# EAGLE design Easy_RFPA_RevB_S2 (EAGLE 6.6.0)
AUTHOR: MDT; BOMREV: 01; FABREV: B
Assembly variants: IRF520N_20W, IRF630_200W

## Sheet 1 of 4: Push-pull power stage
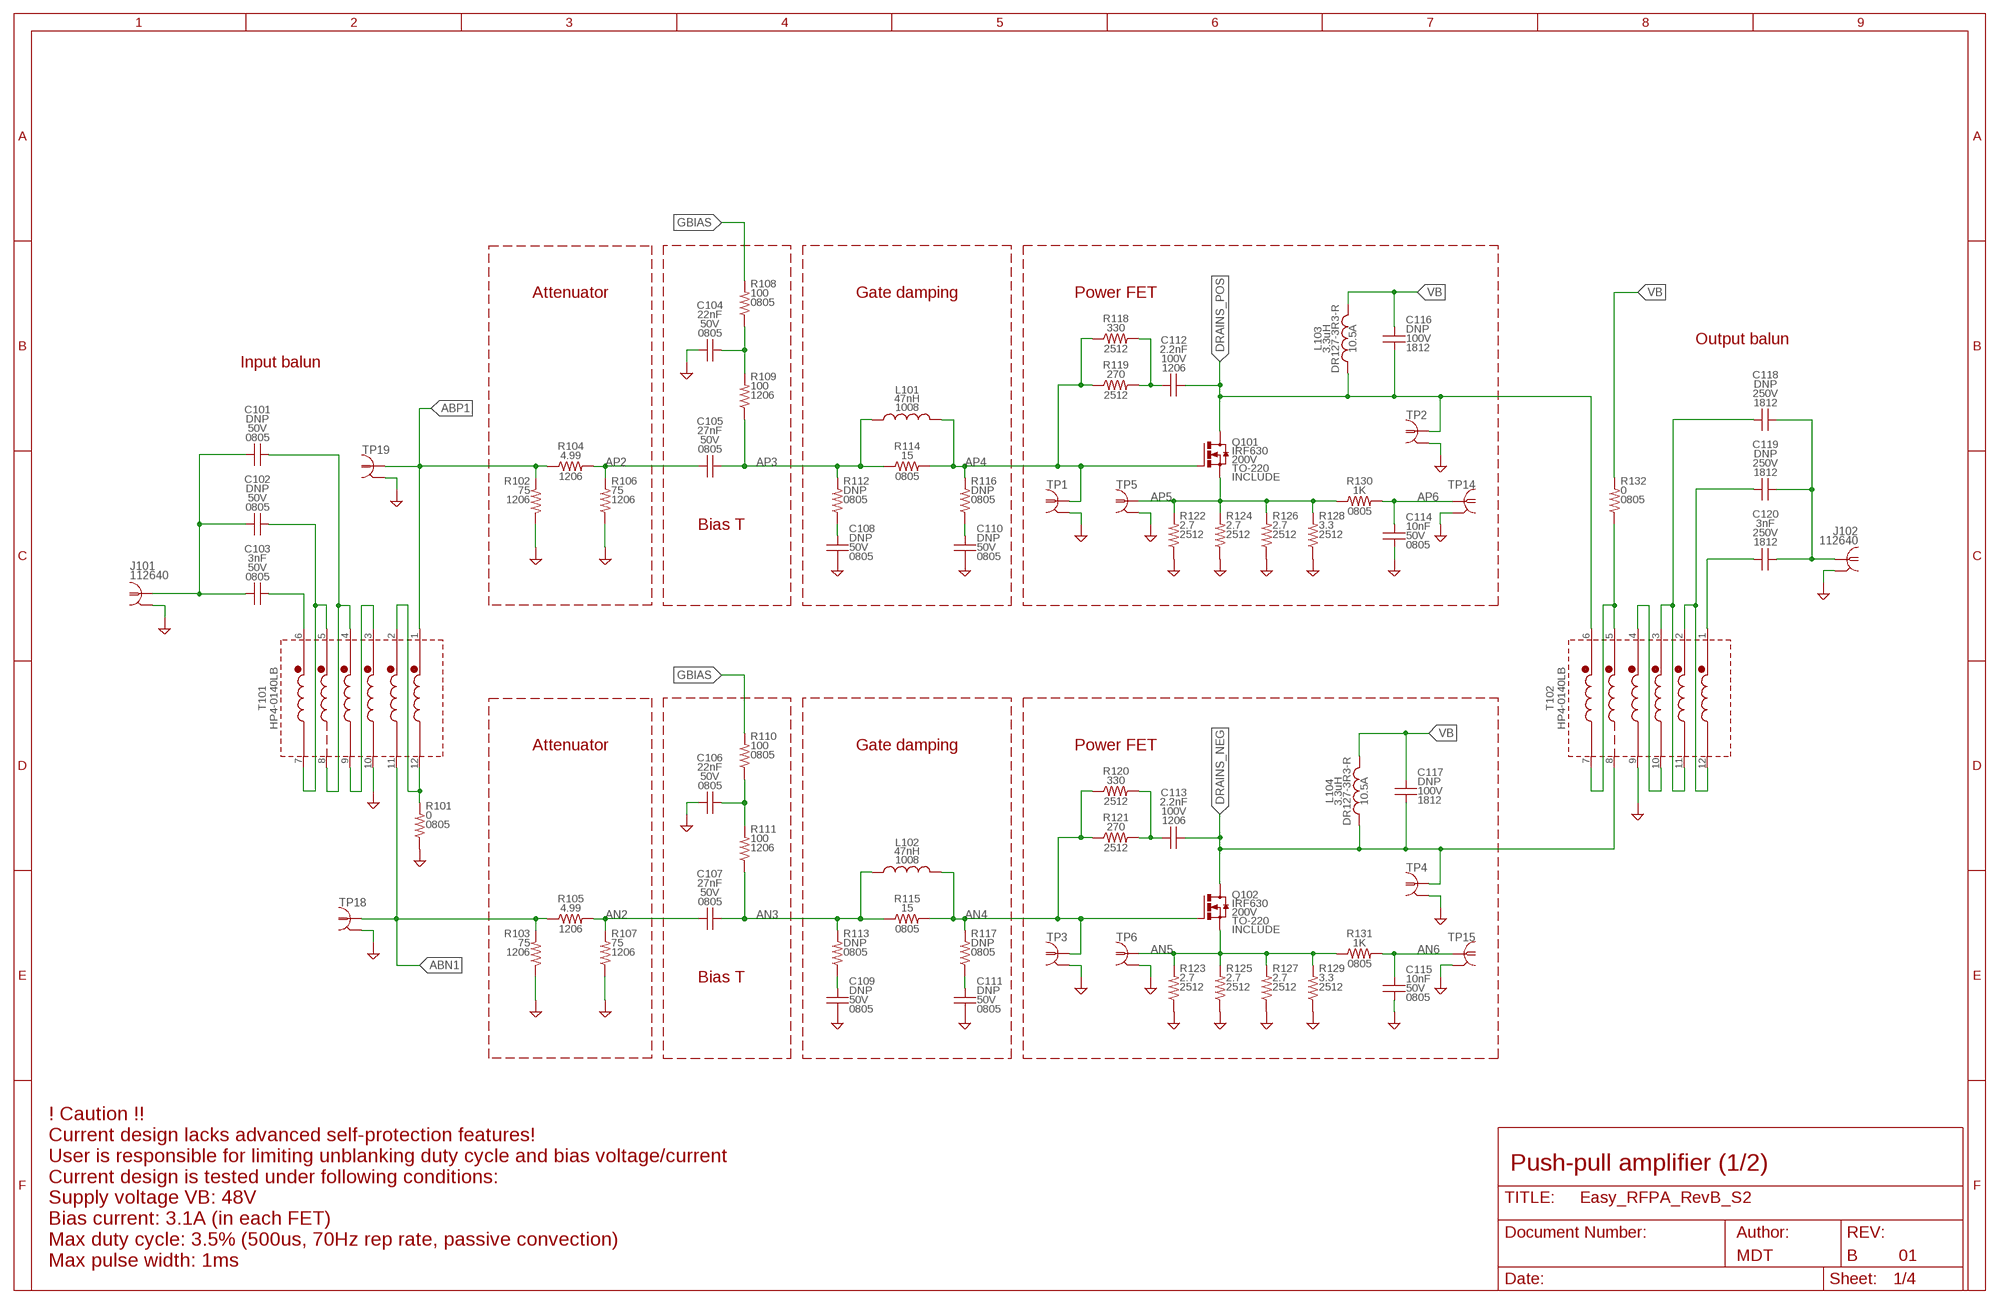
[diagram p0: schematic, sheet 1]

### Parts
C101  DNP  CGEN0805_IPC  [0805_IPC-7351B]  (not fitted in variant IRF630_200W)
C102  DNP  CGEN0805_IPC  [0805_IPC-7351B]  (not fitted in variant IRF520N_20W)  (not fitted in variant IRF630_200W)
C103  3nF  CGEN0805_IPC  [0805_IPC-7351B]  (not fitted in variant IRF520N_20W)
C104  22nF  CGEN0805_IPC  [0805_IPC-7351B]
C105  27nF  CGEN0805_IPC  [0805_IPC-7351B]
C106  22nF  CGEN0805_IPC  [0805_IPC-7351B]
C107  27nF  CGEN0805_IPC  [0805_IPC-7351B]
C108  DNP  CGEN0805_IPC  [0805_IPC-7351B]  (not fitted in variant IRF520N_20W)  (not fitted in variant IRF630_200W)
C109  DNP  CGEN0805_IPC  [0805_IPC-7351B]  (not fitted in variant IRF520N_20W)  (not fitted in variant IRF630_200W)
C110  DNP  CGEN0805_IPC  [0805_IPC-7351B]  (not fitted in variant IRF520N_20W)  (not fitted in variant IRF630_200W)
C111  DNP  CGEN0805_IPC  [0805_IPC-7351B]  (not fitted in variant IRF520N_20W)  (not fitted in variant IRF630_200W)
C112  2.2nF  CGENC1206  [C1206]
C113  2.2nF  CGENC1206  [C1206]
C114  10nF  CGEN0805_IPC  [0805_IPC-7351B]
C115  10nF  CGEN0805_IPC  [0805_IPC-7351B]
C116  DNP  CGENC1812  [C1812]
C117  DNP  CGENC1812  [C1812]
C118  DNP  CGENC1812  [C1812]  (not fitted in variant IRF630_200W)
C119  DNP  CGENC1812  [C1812]  (not fitted in variant IRF520N_20W)  (not fitted in variant IRF630_200W)
C120  3nF  CGENC1812  [C1812]  (not fitted in variant IRF520N_20W)  (variant IRF630_200W: 1.5nF)
J101  COAX112640BNC_EDGE  [BNC_EDGE]
J102  COAX112640BNC_EDGE  [BNC_EDGE]
L101  47nH  L_CHIPL-47N-AIR-5%-1008-1A1008  [L1008]
L102  47nH  L_CHIPL-47N-AIR-5%-1008-1A1008  [L1008]
L103  3.3uH  LL-3.3U-FERRITE-20%-12.5X12.5MM-10.5A  [DR127]  (variant IRF520N_20W: 22uH)
L104  3.3uH  LL-3.3U-FERRITE-20%-12.5X12.5MM-10.5A  [DR127]  (variant IRF520N_20W: 22uH)
Q101  IRF520N  MOSFET_NIRF630TO-220-VERT  [TO220BV]
Q102  IRF630  MOSFET_NIRF630TO-220-VERT  [TO220BV]
R101  0  RGEN0805_IPC  [0805_IPC-7351B]
R102  75  RGEN1206_IPC  [1206_IPC-7351B]
R103  75  RGEN1206_IPC  [1206_IPC-7351B]
R104  4.99  R90GEN1206_IPC  [1206_IPC-7351B]
R105  4.99  R90GEN1206_IPC  [1206_IPC-7351B]
R106  75  RGEN1206_IPC  [1206_IPC-7351B]
R107  75  RGEN1206_IPC  [1206_IPC-7351B]
R108  100  RGEN0805_IPC  [0805_IPC-7351B]
R109  100  RGEN1206_IPC  [1206_IPC-7351B]
R110  100  RGEN0805_IPC  [0805_IPC-7351B]
R111  100  RGEN1206_IPC  [1206_IPC-7351B]
R112  DNP  RGEN0805_IPC  [0805_IPC-7351B]  (not fitted in variant IRF520N_20W)  (not fitted in variant IRF630_200W)
R113  DNP  RGEN0805_IPC  [0805_IPC-7351B]  (not fitted in variant IRF520N_20W)  (not fitted in variant IRF630_200W)
R114  15  R90GEN0805_IPC  [0805_IPC-7351B]
R115  15  R90GEN0805_IPC  [0805_IPC-7351B]
R116  DNP  RGEN0805_IPC  [0805_IPC-7351B]  (not fitted in variant IRF520N_20W)  (not fitted in variant IRF630_200W)
R117  DNP  RGEN0805_IPC  [0805_IPC-7351B]  (not fitted in variant IRF520N_20W)  (not fitted in variant IRF630_200W)
R118  330  R90GENR2512  [R2512]
R119  270  R90GENR2512  [R2512]
R120  330  R90GENR2512  [R2512]
R121  270  R90GENR2512  [R2512]
R122  2.7  RGENR2512  [R2512]
R123  2.7  RGENR2512  [R2512]
R124  2.7  RGENR2512  [R2512]
R125  2.7  RGENR2512  [R2512]
R126  2.7  RGENR2512  [R2512]
R127  2.7  RGENR2512  [R2512]
R128  3.3  RGENR2512  [R2512]
R129  3.3  RGENR2512  [R2512]
R130  1K  R90GEN0805_IPC  [0805_IPC-7351B]
R131  1K  R90GEN0805_IPC  [0805_IPC-7351B]
R132  0  RGEN0805_IPC  [0805_IPC-7351B]
T101  HP4_TRAFO  [HP4]
T102  HP4_TRAFO  [HP4]
TP1  PROBE_TPTP_5MM  [PROBE_TP_5MM]
TP2  PROBE_TPTP_7P5MM  [PROBE_TP_7P5MM]
TP3  PROBE_TPTP_5MM  [PROBE_TP_5MM]
TP4  PROBE_TPTP_7P5MM  [PROBE_TP_7P5MM]
TP5  PROBE_TPTP_7P5MM  [PROBE_TP_7P5MM]
TP6  PROBE_TPTP_7P5MM  [PROBE_TP_7P5MM]
TP14  PROBE_TPTP_5MM  [PROBE_TP_5MM]
TP15  PROBE_TPTP_5MM  [PROBE_TP_5MM]
TP18  PROBE_TPTP_5MM  [PROBE_TP_5MM]
TP19  PROBE_TPTP_5MM  [PROBE_TP_5MM]

### Nets
ABN1: R103.1 R105.1 T101.11(F2) TP18.TP ; also sheet 2
ABP1: R102.1 R104.1 T101.1(S1) TP19.TP ; also sheet 2
AN2: C107.2 R105.2 R107.1
AN3: C107.1 L102.1 R111.2 R113.1 R115.1
AN4: L102.2 Q102.G R115.2 R117.1 R120.1 R121.1 TP3.TP
AN5: Q102.S R123.1 R125.1 R127.1 R129.1 R131.1 TP6.TP
AN6: C115.1 R131.2 TP15.TP
AP2: C105.2 R104.2 R106.1
AP3: C105.1 L101.1 R109.2 R112.1 R114.1
AP4: L101.2 Q101.G R114.2 R116.1 R118.1 R119.1 TP1.TP
AP5: Q101.S R122.1 R124.1 R126.1 R128.1 R130.1 TP5.TP
AP6: C114.1 R130.2 TP14.TP
DRAINS_NEG [32W_20S]: C113.2 C117.2 L104.1 Q102.D T102.8(F5) TP4.TP ; also sheet 2
DRAINS_POS [32W_30S]: C112.2 C116.2 L103.1 Q101.D T102.6(S6) TP2.TP ; also sheet 2
GBIAS: R108.1 R110.1 ; also sheet 2,3
GND: C104.2 C106.2 C108.2 C109.2 C110.2 C111.2 C114.2 C115.2 J101.G1(GND1) J101.G2(GND1) J101.G3(GND1) J101.G4(GND1) J102.G1(GND1) J102.G2(GND1) J102.G3(GND1) J102.G4(GND1) R101.2 R102.2 R103.2 R106.2 R107.2 R122.2 R123.2 R124.2 R125.2 R126.2 R127.2 R128.2 R129.2 T101.10(F3) T102.9(F4) TP1.GND(GND1) TP2.GND(GND1) TP3.GND(GND1) TP4.GND(GND1) TP5.GND(GND1) TP6.GND(GND1) TP14.GND(GND1) TP15.GND(GND1) TP18.GND(GND1) TP19.GND(GND1) ; also sheet 2,3,4
N$4: C113.1 R120.2 R121.2
N$5: C109.1 R113.2
N$8: C104.1 R108.2 R109.1
N$10: C108.1 R112.2
N$11: C110.1 R116.2
N$12: C112.1 R118.2 R119.2
N$13: C106.1 R110.2 R111.1
N$17: C111.1 R117.2
N$22: T101.3(S3) T101.9(F4)
N$27: R101.1 T101.2(S2) T101.12(F1)
N$29 [32W_30S]: C119.1 T102.2(S2) T102.12(F1)
N$30 [32W_30S]: C120.1 T102.1(S1)
N$31 [32W_30S]: C118.2 C119.2 C120.2 J102.C
N$34: C101.2 C102.2 C103.2 J101.C
N$41: C103.1 T101.6(S6)
N$52 [32W_30S]: C118.1 T102.3(S3) T102.11(F2)
N$57: C101.1 T101.4(S4) T101.8(F5)
N$58 [32W_30S]: T102.4(S4) T102.10(F3)
VB [50W_30S]: C116.1 C117.1 L103.2 L104.2 R132.1 ; also sheet 4
VB_CT [32W_30S]: R132.2 T102.5(S5) T102.7(F6)
VB_CT1: C102.1 T101.5(S5) T101.7(F6)

### Notes on the sheet
- Attenuator | Gate damping | Power FET
- Output balun
- Input balun
- Bias T
- Attenuator | Gate damping | Power FET
- Bias T
- Push-pull amplifier (1/2)
- ! Caution !!
  Current design lacks advanced self-protection features!
  User is responsible for limiting unblanking duty cycle and bias voltage/current
  Current design is tested under following conditions:
  Supply voltage VB: 48V
  Bias current: 3.1A (in each FET)
  Max duty cycle: 3.5% (500us, 70Hz rep rate, passive convection)
  Max pulse width: 1ms

## Sheet 2 of 4: Parallel copy of push-pull power stage
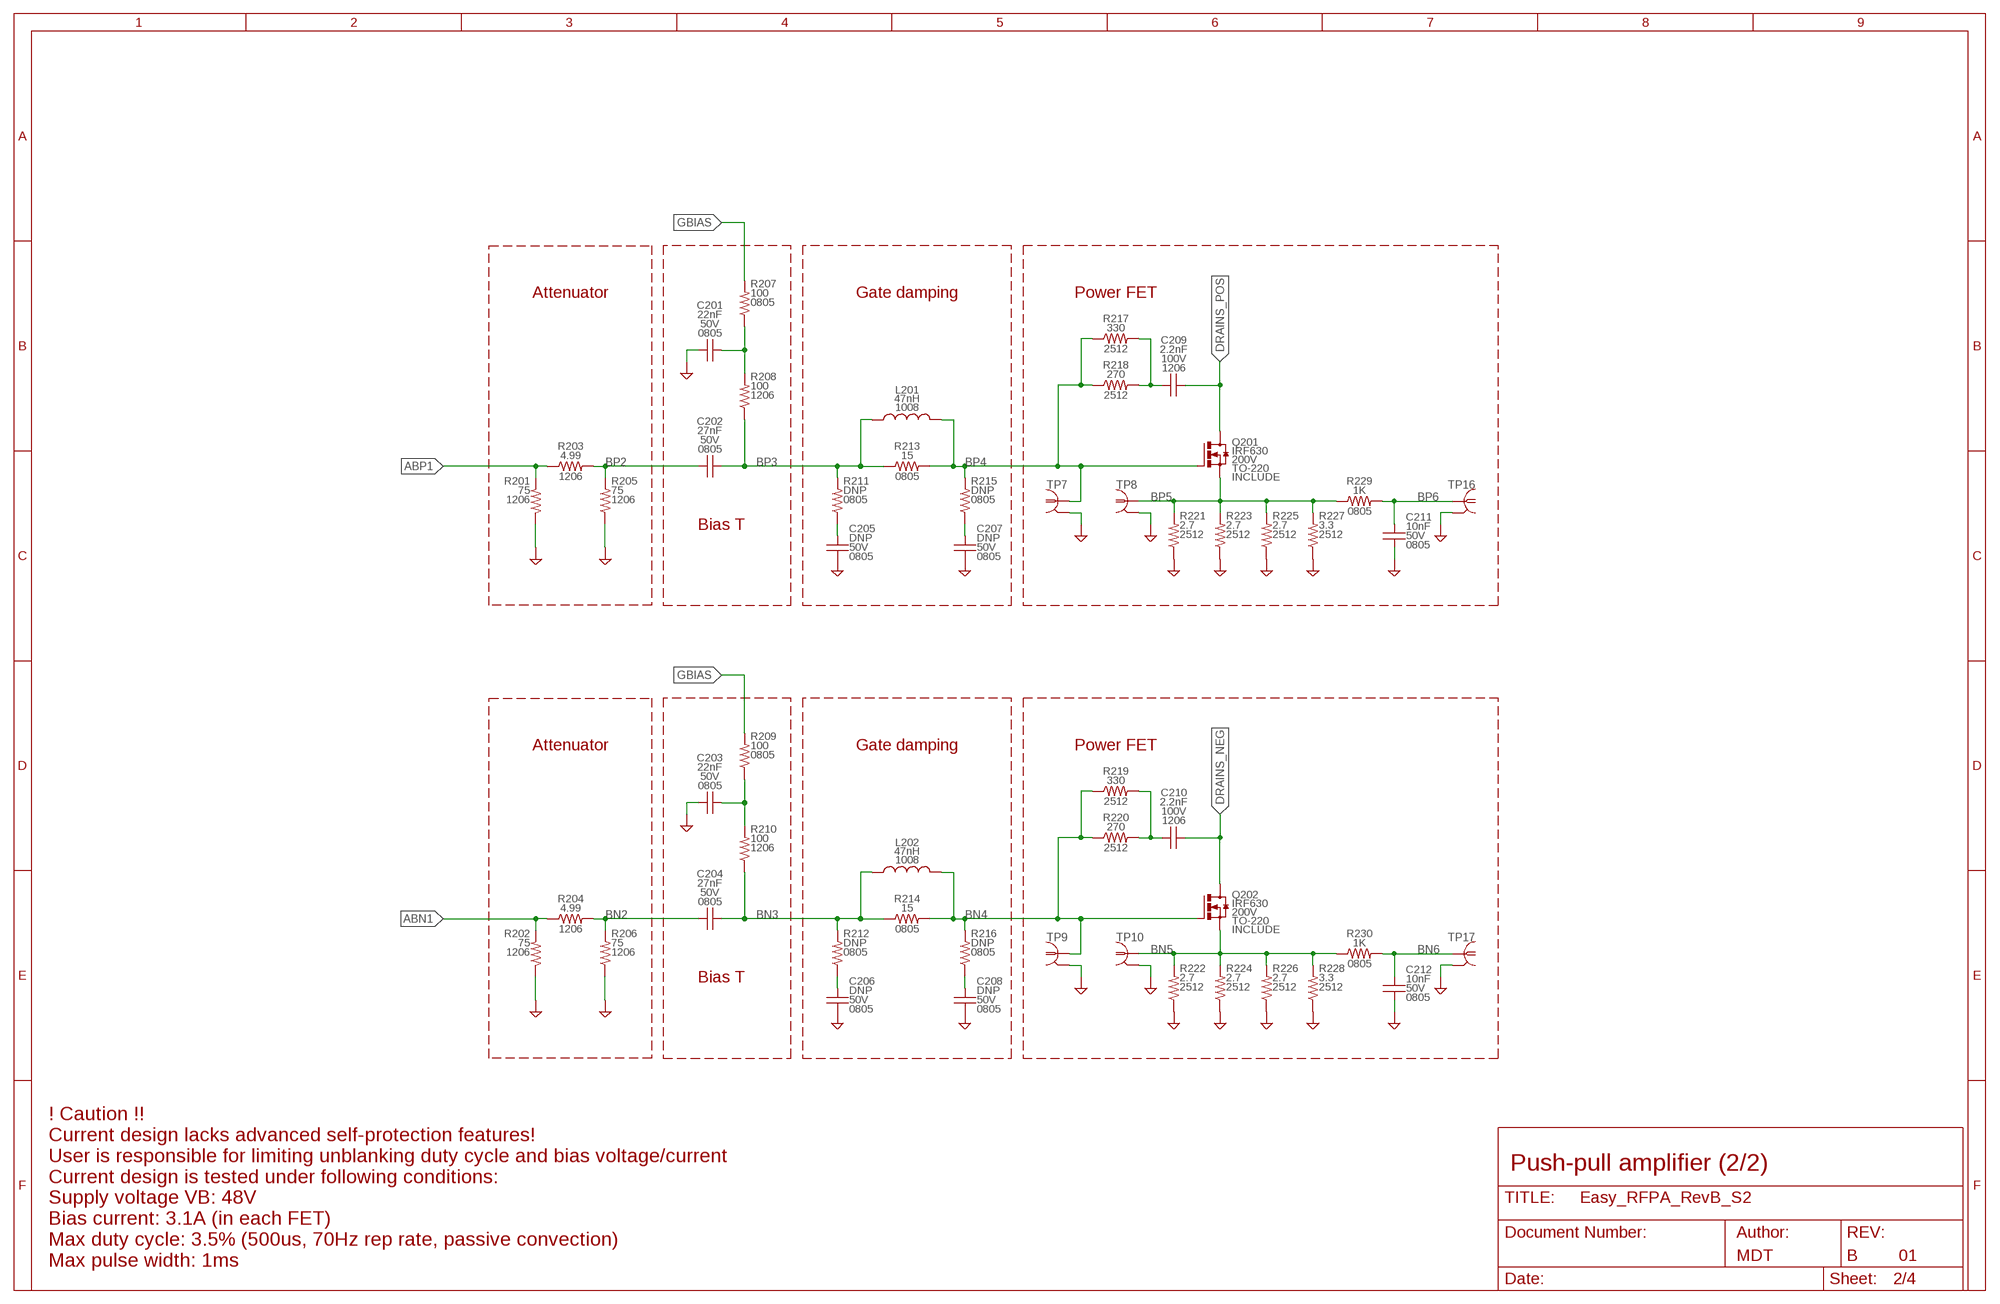
[diagram p1: schematic, sheet 2]

### Parts
C201  22nF  CGEN0805_IPC  [0805_IPC-7351B]  (not fitted in variant IRF520N_20W)
C202  27nF  CGEN0805_IPC  [0805_IPC-7351B]  (not fitted in variant IRF520N_20W)
C203  22nF  CGEN0805_IPC  [0805_IPC-7351B]  (not fitted in variant IRF520N_20W)
C204  27nF  CGEN0805_IPC  [0805_IPC-7351B]  (not fitted in variant IRF520N_20W)
C205  DNP  CGEN0805_IPC  [0805_IPC-7351B]  (not fitted in variant IRF520N_20W)  (not fitted in variant IRF630_200W)
C206  DNP  CGEN0805_IPC  [0805_IPC-7351B]  (not fitted in variant IRF520N_20W)  (not fitted in variant IRF630_200W)
C207  DNP  CGEN0805_IPC  [0805_IPC-7351B]  (not fitted in variant IRF520N_20W)  (not fitted in variant IRF630_200W)
C208  DNP  CGEN0805_IPC  [0805_IPC-7351B]  (not fitted in variant IRF520N_20W)  (not fitted in variant IRF630_200W)
C209  2.2nF  CGENC1206  [C1206]  (not fitted in variant IRF520N_20W)
C210  2.2nF  CGENC1206  [C1206]  (not fitted in variant IRF520N_20W)
C211  10nF  CGEN0805_IPC  [0805_IPC-7351B]  (not fitted in variant IRF520N_20W)
C212  10nF  CGEN0805_IPC  [0805_IPC-7351B]  (not fitted in variant IRF520N_20W)
L201  47nH  L_CHIPL-47N-AIR-5%-1008-1A1008  [L1008]  (not fitted in variant IRF520N_20W)
L202  47nH  L_CHIPL-47N-AIR-5%-1008-1A1008  [L1008]  (not fitted in variant IRF520N_20W)
Q201  IRF630  MOSFET_NIRF630TO-220-VERT  [TO220BV]  (not fitted in variant IRF520N_20W)
Q202  IRF630  MOSFET_NIRF630TO-220-VERT  [TO220BV]  (not fitted in variant IRF520N_20W)
R201  75  RGEN1206_IPC  [1206_IPC-7351B]  (not fitted in variant IRF520N_20W)
R202  75  RGEN1206_IPC  [1206_IPC-7351B]  (not fitted in variant IRF520N_20W)
R203  4.99  R90GEN1206_IPC  [1206_IPC-7351B]  (not fitted in variant IRF520N_20W)
R204  4.99  R90GEN1206_IPC  [1206_IPC-7351B]  (not fitted in variant IRF520N_20W)
R205  75  RGEN1206_IPC  [1206_IPC-7351B]  (not fitted in variant IRF520N_20W)
R206  75  RGEN1206_IPC  [1206_IPC-7351B]  (not fitted in variant IRF520N_20W)
R207  100  RGEN0805_IPC  [0805_IPC-7351B]  (not fitted in variant IRF520N_20W)
R208  100  RGEN1206_IPC  [1206_IPC-7351B]  (not fitted in variant IRF520N_20W)
R209  100  RGEN0805_IPC  [0805_IPC-7351B]  (not fitted in variant IRF520N_20W)
R210  100  RGEN1206_IPC  [1206_IPC-7351B]  (not fitted in variant IRF520N_20W)
R211  DNP  RGEN0805_IPC  [0805_IPC-7351B]  (not fitted in variant IRF520N_20W)  (not fitted in variant IRF630_200W)
R212  DNP  RGEN0805_IPC  [0805_IPC-7351B]  (not fitted in variant IRF520N_20W)  (not fitted in variant IRF630_200W)
R213  15  R90GEN0805_IPC  [0805_IPC-7351B]  (not fitted in variant IRF520N_20W)
R214  15  R90GEN0805_IPC  [0805_IPC-7351B]  (not fitted in variant IRF520N_20W)
R215  DNP  RGEN0805_IPC  [0805_IPC-7351B]  (not fitted in variant IRF520N_20W)  (not fitted in variant IRF630_200W)
R216  DNP  RGEN0805_IPC  [0805_IPC-7351B]  (not fitted in variant IRF520N_20W)  (not fitted in variant IRF630_200W)
R217  330  R90GENR2512  [R2512]  (not fitted in variant IRF520N_20W)
R218  270  R90GENR2512  [R2512]  (not fitted in variant IRF520N_20W)
R219  330  R90GENR2512  [R2512]  (not fitted in variant IRF520N_20W)
R220  270  R90GENR2512  [R2512]  (not fitted in variant IRF520N_20W)
R221  2.7  RGENR2512  [R2512]  (not fitted in variant IRF520N_20W)
R222  2.7  RGENR2512  [R2512]  (not fitted in variant IRF520N_20W)
R223  2.7  RGENR2512  [R2512]  (not fitted in variant IRF520N_20W)
R224  2.7  RGENR2512  [R2512]  (not fitted in variant IRF520N_20W)
R225  2.7  RGENR2512  [R2512]  (not fitted in variant IRF520N_20W)
R226  2.7  RGENR2512  [R2512]  (not fitted in variant IRF520N_20W)
R227  3.3  RGENR2512  [R2512]  (not fitted in variant IRF520N_20W)
R228  3.3  RGENR2512  [R2512]  (not fitted in variant IRF520N_20W)
R229  1K  R90GEN0805_IPC  [0805_IPC-7351B]  (not fitted in variant IRF520N_20W)
R230  1K  R90GEN0805_IPC  [0805_IPC-7351B]  (not fitted in variant IRF520N_20W)
TP7  PROBE_TPTP_5MM  [PROBE_TP_5MM]
TP8  PROBE_TPTP_7P5MM  [PROBE_TP_7P5MM]
TP9  PROBE_TPTP_5MM  [PROBE_TP_5MM]
TP10  PROBE_TPTP_7P5MM  [PROBE_TP_7P5MM]
TP16  PROBE_TPTP_5MM  [PROBE_TP_5MM]
TP17  PROBE_TPTP_5MM  [PROBE_TP_5MM]

### Nets
ABN1: R202.1 R204.1 ; also sheet 1
ABP1: R201.1 R203.1 ; also sheet 1
BN2: C204.2 R204.2 R206.1
BN3: C204.1 L202.1 R210.2 R212.1 R214.1
BN4: L202.2 Q202.G R214.2 R216.1 R219.1 R220.1 TP9.TP
BN5: Q202.S R222.1 R224.1 R226.1 R228.1 R230.1 TP10.TP
BN6: C212.1 R230.2 TP17.TP
BP2: C202.2 R203.2 R205.1
BP3: C202.1 L201.1 R208.2 R211.1 R213.1
BP4: L201.2 Q201.G R213.2 R215.1 R217.1 R218.1 TP7.TP
BP5: Q201.S R221.1 R223.1 R225.1 R227.1 R229.1 TP8.TP
BP6: C211.1 R229.2 TP16.TP
DRAINS_NEG [32W_20S]: C210.2 Q202.D ; also sheet 1
DRAINS_POS [32W_30S]: C209.2 Q201.D ; also sheet 1
GBIAS: R207.1 R209.1 ; also sheet 1,3
GND: C201.2 C203.2 C205.2 C206.2 C207.2 C208.2 C211.2 C212.2 R201.2 R202.2 R205.2 R206.2 R221.2 R222.2 R223.2 R224.2 R225.2 R226.2 R227.2 R228.2 TP7.GND(GND1) TP8.GND(GND1) TP9.GND(GND1) TP10.GND(GND1) TP16.GND(GND1) TP17.GND(GND1) ; also sheet 1,3,4
N$35: C203.1 R209.2 R210.1
N$36: C206.1 R212.2
N$38: C208.1 R216.2
N$39: C210.1 R219.2 R220.2
N$40: C201.1 R207.2 R208.1
N$42: C205.1 R211.2
N$48: C207.1 R215.2
N$50: C209.1 R217.2 R218.2

### Notes on the sheet
- Attenuator | Gate damping | Power FET
- Bias T
- Attenuator | Gate damping | Power FET
- Bias T
- Push-pull amplifier (2/2)
- ! Caution !!
  Current design lacks advanced self-protection features!
  User is responsible for limiting unblanking duty cycle and bias voltage/current
  Current design is tested under following conditions:
  Supply voltage VB: 48V
  Bias current: 3.1A (in each FET)
  Max duty cycle: 3.5% (500us, 70Hz rep rate, passive convection)
  Max pulse width: 1ms

## Sheet 3 of 4: Gate bias driver
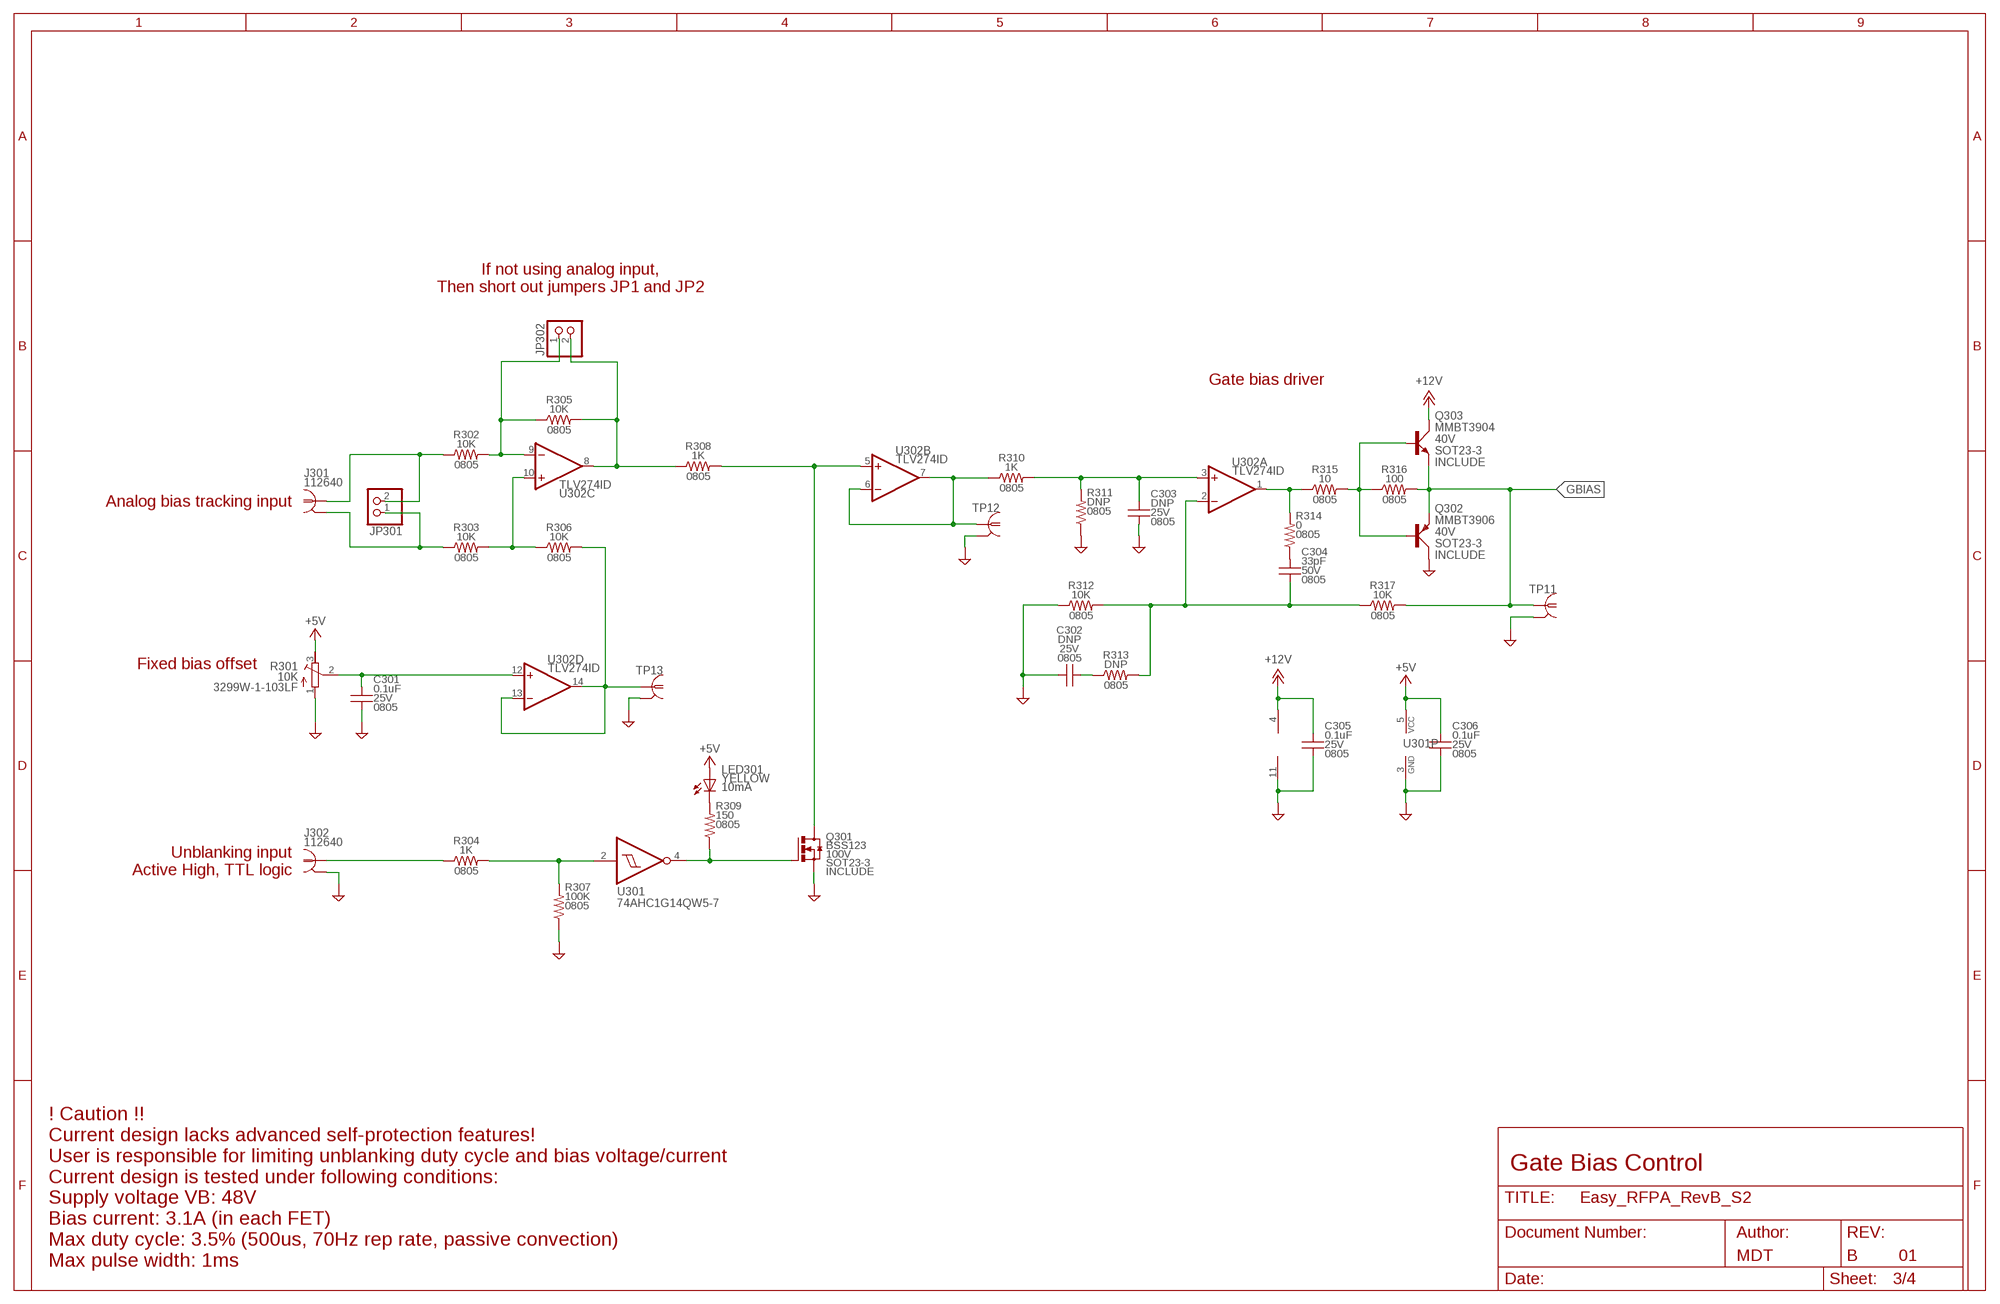
[diagram p2: schematic, sheet 3]

### Parts
C301  0.1uF  CGEN0805_IPC  [0805_IPC-7351B]
C302  DNP  CGEN0805_IPC  [0805_IPC-7351B]  (not fitted in variant IRF520N_20W)  (not fitted in variant IRF630_200W)
C303  DNP  CGEN0805_IPC  [0805_IPC-7351B]  (not fitted in variant IRF520N_20W)  (not fitted in variant IRF630_200W)
C304  33pF  CGEN0805_IPC  [0805_IPC-7351B]
C305  0.1uF  CGEN0805_IPC  [0805_IPC-7351B]
C306  0.1uF  CGEN0805_IPC  [0805_IPC-7351B]
J301  COAX112640BNC_EDGE  [BNC_EDGE]
J302  COAX112640BNC_EDGE  [BNC_EDGE]
JP301  PINHD-1X2  [1X02]
JP302  PINHD-1X2  [1X02]
LED301  LEDHLMP-3401-E0002T1_3/4  [LED5MM]
Q301  MOSFET_NBSS123SOT23  [SOT23R_INFINEON]
Q302  PNPSOT23_BEC  [SOT23R_INFINEON]
Q303  NPNMMBT3904SOT23_BEC  [SOT23R_INFINEON]
R301  10K  RTRIMRTRIM-10K-10%-3299W-0.5W3299W  [RTRIM3299W]
R302  10K  R90GEN0805_IPC  [0805_IPC-7351B]
R303  10K  R90GEN0805_IPC  [0805_IPC-7351B]
R304  1K  R90GEN0805_IPC  [0805_IPC-7351B]
R305  10K  R90GEN0805_IPC  [0805_IPC-7351B]
R306  10K  R90GEN0805_IPC  [0805_IPC-7351B]
R307  100K  RGEN0805_IPC  [0805_IPC-7351B]
R308  1K  R90GEN0805_IPC  [0805_IPC-7351B]
R309  150  RGEN0805_IPC  [0805_IPC-7351B]
R310  1K  R90GEN0805_IPC  [0805_IPC-7351B]
R311  DNP  RGEN0805_IPC  [0805_IPC-7351B]  (not fitted in variant IRF520N_20W)  (not fitted in variant IRF630_200W)
R312  10K  R90GEN0805_IPC  [0805_IPC-7351B]
R313  DNP  R90GEN0805_IPC  [0805_IPC-7351B]  (not fitted in variant IRF520N_20W)  (not fitted in variant IRF630_200W)
R314  0  RGEN0805_IPC  [0805_IPC-7351B]
R315  10  R90GEN0805_IPC  [0805_IPC-7351B]
R316  100  R90GEN0805_IPC  [0805_IPC-7351B]
R317  10K  R90GEN0805_IPC  [0805_IPC-7351B]
TP11  PROBE_TPTP_5MM  [PROBE_TP_5MM]
TP12  PROBE_TPTP_5MM  [PROBE_TP_5MM]
TP13  PROBE_TPTP_5MM  [PROBE_TP_5MM]
U301  74AHC1G14DBV  [SOT23-5]
U302  OPAMP_QUADTLV274IDSOIC14  [SO14]

### Nets
+5V: C306.1 LED301.A R301.3(E) U301.5(VCC) ; also sheet 4
+12V: C305.1 Q303.3(C) U302.4(P:V+) ; also sheet 4
GBIAS: Q302.2(E) Q303.2(E) R316.2 R317.2 TP11.TP ; also sheet 1,2
GND: C301.2 C302.2 C303.2 C305.2 C306.2 J302.G1(GND1) J302.G2(GND1) J302.G3(GND1) J302.G4(GND1) Q301.2(S) Q302.3(C) R301.1(A) R307.2 R311.2 R312.1 TP11.GND(GND1) TP12.GND(GND1) TP13.GND(GND1) U301.3(GND) U302.11(P:V-) ; also sheet 1,2,4
N$1: R314.1 R315.1 U302.1(A:OUT)
N$2: Q302.1(B) Q303.1(B) R315.2 R316.1
N$3: R304.2 R307.1 U301.2(I)
N$6: R310.1 TP12.TP U302.6(B:-IN) U302.7(B:OUT)
N$7: C304.1 R314.2
N$9: C302.1 R313.1
N$14: C304.2 R312.2 R313.2 R317.1 U302.2(A:-IN)
N$15: C303.1 R310.2 R311.1 U302.3(A:+IN)
N$16: R303.2 R306.1 U302.10(C:+IN)
N$18: JP302.2 R305.2 R308.1 U302.8(C:OUT)
N$19: JP302.1 R302.2 R305.1 U302.9(C:-IN)
N$20: J301.C JP301.2 R302.1
N$21: J301.G1(GND1) J301.G2(GND1) J301.G3(GND1) J301.G4(GND1) JP301.1 R303.1
N$23: Q301.3(D) R308.2 U302.5(B:+IN)
N$24: Q301.1(G) R309.2 U301.4(O)
N$25: C301.1 R301.2(S) U302.12(D:+IN)
N$26: R306.2 TP13.TP U302.13(D:-IN) U302.14(D:OUT)
N$37: LED301.K(C) R309.1
N$53: J302.C R304.1

### Notes on the sheet
- If not using analog input,
  Then short out jumpers JP1 and JP2
- Gate bias driver
- Analog bias tracking input
- Fixed bias offset
- Unblanking input
  Active High, TTL logic
- Gate Bias Control
- ! Caution !!
  Current design lacks advanced self-protection features!
  User is responsible for limiting unblanking duty cycle and bias voltage/current
  Current design is tested under following conditions:
  Supply voltage VB: 48V
  Bias current: 3.1A (in each FET)
  Max duty cycle: 3.5% (500us, 70Hz rep rate, passive convection)
  Max pulse width: 1ms

## Sheet 4 of 4: Power entry
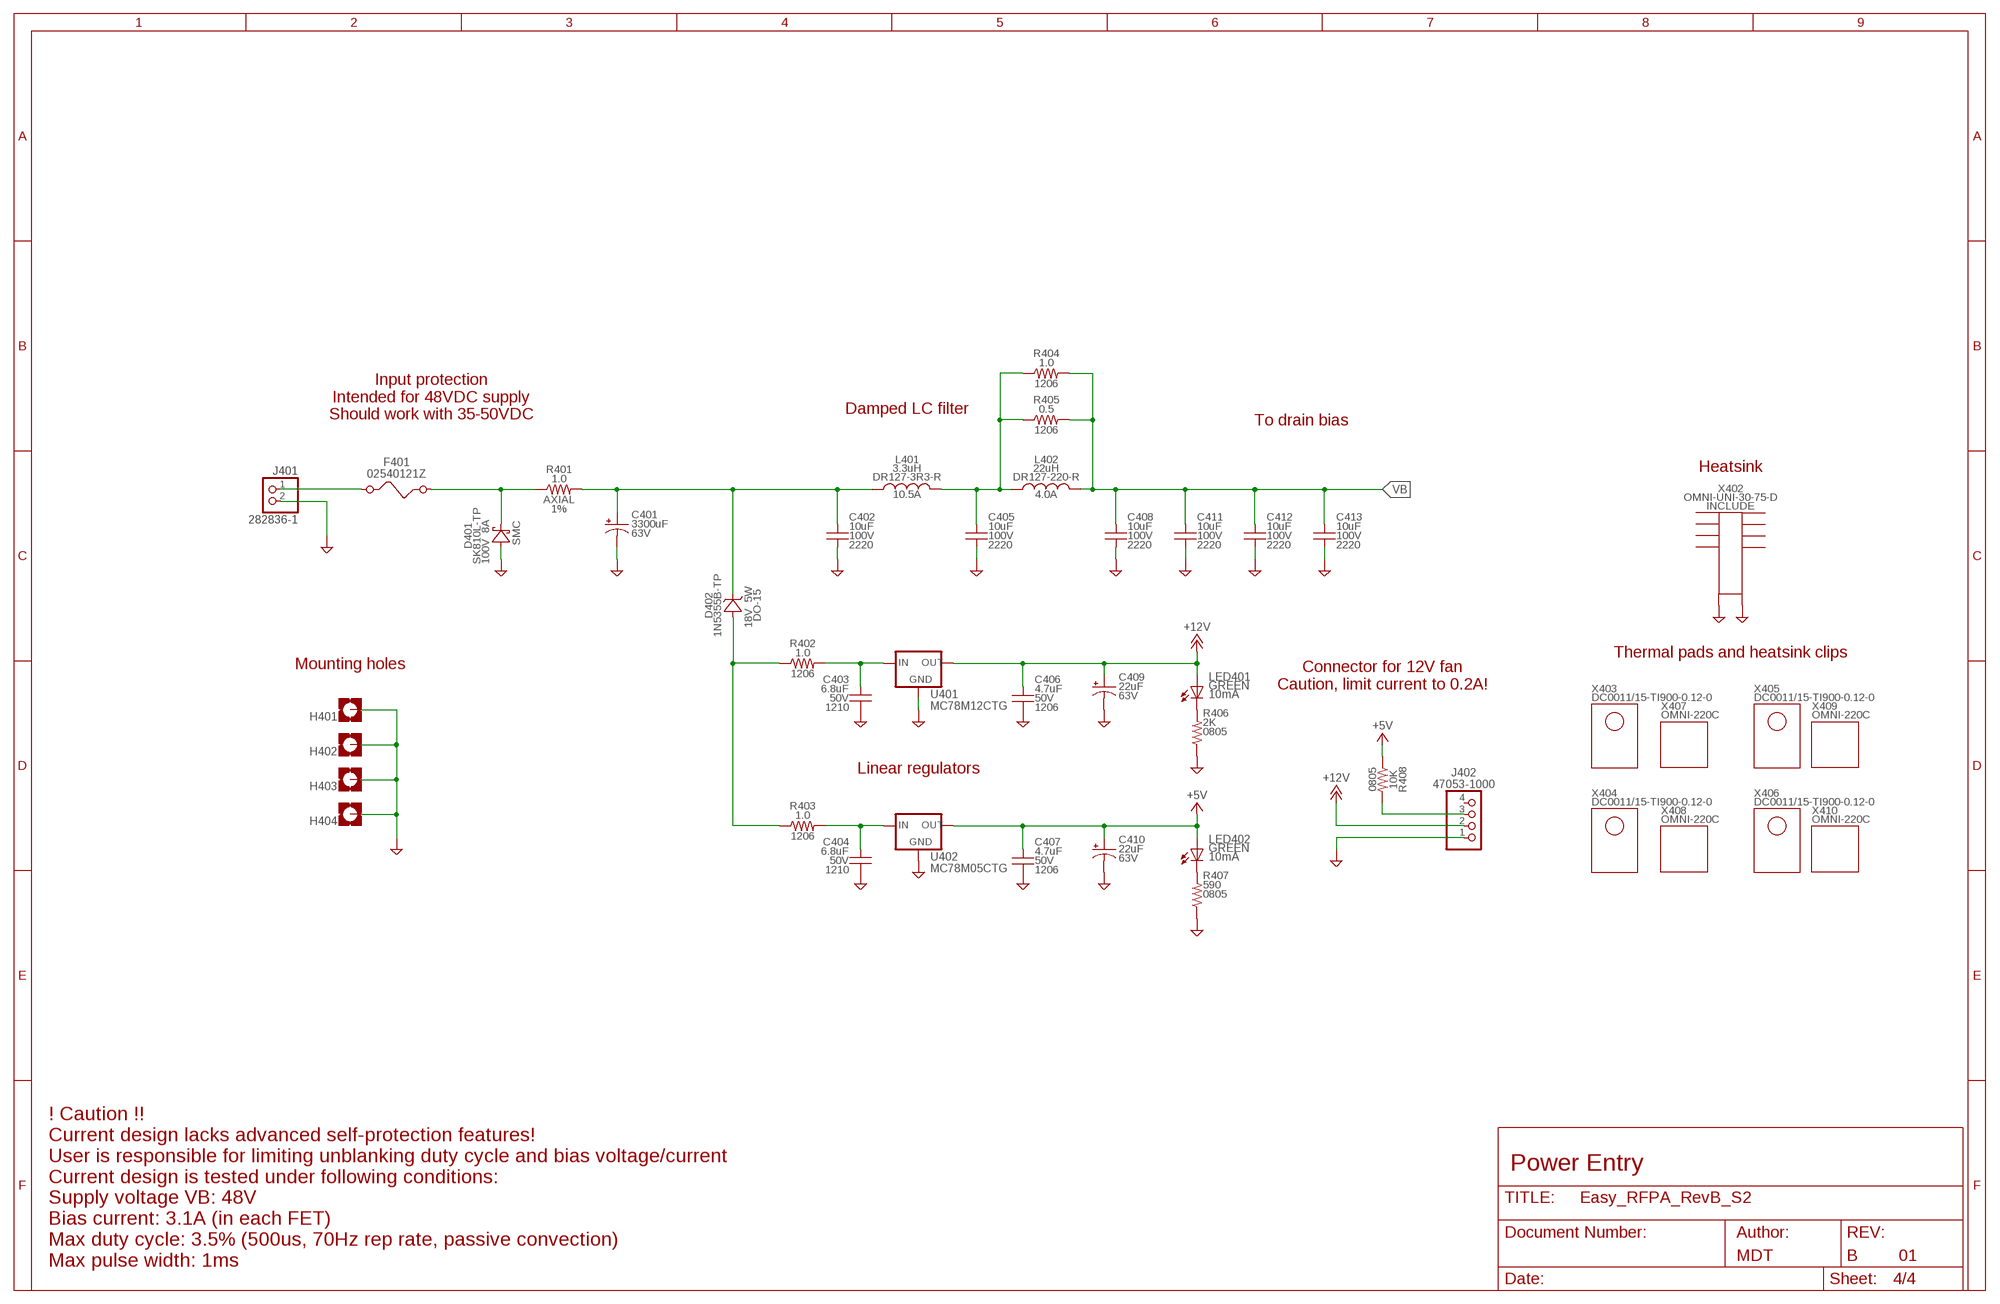
[diagram p3: schematic, sheet 4]
X403 (THERMALPAD_TO220DC0011/15-TI900-0.12-0): BOM: INCLUDE; DESCRIPTION: THERM PAD 21.84MMX18.79MM WHITE; MATERIAL: Ti900; PARTNO: DC0011/15-TI900-0.12-0; VENDOR: t-Global Technology
X404 (THERMALPAD_TO220DC0011/15-TI900-0.12-0): BOM: INCLUDE; DESCRIPTION: THERM PAD 21.84MMX18.79MM WHITE; MATERIAL: Ti900; PARTNO: DC0011/15-TI900-0.12-0; VENDOR: t-Global Technology
X405 (THERMALPAD_TO220DC0011/15-TI900-0.12-0): BOM: INCLUDE; DESCRIPTION: THERM PAD 21.84MMX18.79MM WHITE; MATERIAL: Ti900; PARTNO: DC0011/15-TI900-0.12-0; VENDOR: t-Global Technology
X406 (THERMALPAD_TO220DC0011/15-TI900-0.12-0): BOM: INCLUDE; DESCRIPTION: THERM PAD 21.84MMX18.79MM WHITE; MATERIAL: Ti900; PARTNO: DC0011/15-TI900-0.12-0; VENDOR: t-Global Technology
X407 (HEATSINK_CLIPOMNI-220C): BOM: INCLUDE; DESCRIPTION: UNIVERSAL TO-220 HEATSINK CLIP; PARTNO: OMNI-220C; VENDOR: Wakefield-Vette
X408 (HEATSINK_CLIPOMNI-220C): BOM: INCLUDE; DESCRIPTION: UNIVERSAL TO-220 HEATSINK CLIP; PARTNO: OMNI-220C; VENDOR: Wakefield-Vette
X409 (HEATSINK_CLIPOMNI-220C): BOM: INCLUDE; DESCRIPTION: UNIVERSAL TO-220 HEATSINK CLIP; PARTNO: OMNI-220C; VENDOR: Wakefield-Vette
X410 (HEATSINK_CLIPOMNI-220C): BOM: INCLUDE; DESCRIPTION: UNIVERSAL TO-220 HEATSINK CLIP; PARTNO: OMNI-220C; VENDOR: Wakefield-Vette

### Parts
C401  3300uF  CPOLC-3300U-63V-20%-25DX37L-ELECEB25D  [EB25D]
C402  10uF  CCC-10U-100V-20%-2220-X7TC2220_CKG57N  [C2220_CKG57N]
C403  6.8uF  CGENC1210  [C1210]
C404  6.8uF  CGENC1210  [C1210]
C405  10uF  CCC-10U-100V-20%-2220-X7TC2220_CKG57N  [C2220_CKG57N]
C406  4.7uF  CGENC1206  [C1206]
C407  4.7uF  CGENC1206  [C1206]
C408  10uF  CCC-10U-100V-20%-2220-X7TC2220_CKG57N  [C2220_CKG57N]
C409  22uF  CPOLC-22U-63V-20%-6.3DX12.5L-ELECE2,5-7  [E2,5-7]
C410  22uF  CPOLC-22U-63V-20%-6.3DX12.5L-ELECE2,5-7  [E2,5-7]
C411  10uF  CCC-10U-100V-20%-2220-X7TC2220_CKG57N  [C2220_CKG57N]
C412  10uF  CCC-10U-100V-20%-2220-X7TC2220_CKG57N  [C2220_CKG57N]
C413  10uF  CCC-10U-100V-20%-2220-X7TC2220_CKG57N  [C2220_CKG57N]
D401  D-SCHOTTKYSK810L-TPSMC  [DO-214AB(SMC)]
D402  D-ZENER1N5355B-TPDO15-12  [DO15-12]
F401  FUSE_2P  [02540121Z]
H401  MOUNT-PAD-SQUARE3.2  [3,2-PAD-SQUARE]
H402  MOUNT-PAD-SQUARE3.2  [3,2-PAD-SQUARE]
H403  MOUNT-PAD-SQUARE3.2  [3,2-PAD-SQUARE]
H404  MOUNT-PAD-SQUARE3.2  [3,2-PAD-SQUARE]
J401  HDR_2X1282836-1282836-1  [W237-02]
J402  KK_PCFAN  [47053-1000]
L401  3.3uH  LL-3.3U-FERRITE-20%-12.5X12.5MM-10.5A  [DR127]
L402  22uH  LL-22U-FERRITE-20%-12.5X12.5MM-4A  [DR127]
LED401  LEDHLMP-3962-F0002T1_3/4  [LED5MM]
LED402  LEDHLMP-3962-F0002T1_3/4  [LED5MM]
R401  1.0  R90R-1.0-1%-AXIAL-3WP0817V  [P0817V]
R402  1.0  R90GENR1206  [R1206]
R403  1.0  R90GENR1206  [R1206]
R404  1.0  R90GEN1206_IPC  [1206_IPC-7351B]
R405  0.5  R90GEN1206_IPC  [1206_IPC-7351B]
R406  2K  RGEN0805_IPC  [0805_IPC-7351B]
R407  590  RGEN0805_IPC  [0805_IPC-7351B]
R408  10K  R90GEN0805_IPC  [0805_IPC-7351B]
U401  LDO_3TERMMC78M12CTGTO220_VERT  [TO220BV]
U402  LDO_3TERMMC78M05CTGTO220_VERT  [TO220BV]
X402  HEATSINK_OMNI_DUALOMNI-UNI-30-75-D30-75-D  [OMNI-UNI-30-75-D]

### Nets
+5V: C407.1 C410.+ LED402.A R408.1 U402.3(OUT) ; also sheet 3
+12V: C406.1 C409.+ J402.2 LED401.A U401.3(OUT) ; also sheet 3
GND: C401.- C402.2 C403.2 C404.2 C405.2 C406.2 C407.2 C408.2 C409.- C410.- C411.2 C412.2 C413.2 D401.A(A1) H401.B3,2(MOUNT) H402.B3,2(MOUNT) H403.B3,2(MOUNT) H404.B3,2(MOUNT) J401.2 J402.1 R406.2 R407.2 U401.2(GND) U402.2(GND) X402.P1 X402.P2 ; also sheet 1,2,3
N$28: D402.A(A1) R402.1 R403.1
N$32: LED401.K(C) R406.1
N$33: LED402.K(C) R407.1
N$43: C403.1 R402.2 U401.1(IN)
N$44: D401.K(C1) F401.2 R401.1
N$45: F401.1 J401.1
N$46: C401.+ C402.1 D402.C(C1) L401.1 R401.2
N$47 [32W_30S]: C405.1 L401.2 L402.1 R404.1 R405.1
N$49: C404.1 R403.2 U402.1(IN)
N$51: J402.3 R408.2
VB [50W_30S]: C408.1 C411.1 C412.1 C413.1 L402.2 R404.2 R405.2 ; also sheet 1
Unconnected: J402.4

### Notes on the sheet
- Input protection
  Intended for 48VDC supply
  Should work with 35-50VDC
- Damped LC filter
- To drain bias
- Heatsink
- Thermal pads and heatsink clips
- Mounting holes
- Connector for 12V fan
  Caution, limit current to 0.2A!
- Linear regulators
- Power Entry
- ! Caution !!
  Current design lacks advanced self-protection features!
  User is responsible for limiting unblanking duty cycle and bias voltage/current
  Current design is tested under following conditions:
  Supply voltage VB: 48V
  Bias current: 3.1A (in each FET)
  Max duty cycle: 3.5% (500us, 70Hz rep rate, passive convection)
  Max pulse width: 1ms

## Library data of the parts
C101 C102 C108-C111 C205-C208 = MDT_C:C; BOM: EXCLUDE; PACKAGE: 0805; VOLTAGE: 50V
C103-C107 C114 C115 C201-C204 C211 C212 C304 = MDT_C:C; BOM: INCLUDE; PACKAGE: 0805; VOLTAGE: 50V
C112 C113 C209 C210 = MDT_C:C; BOM: INCLUDE; PACKAGE: 1206; VOLTAGE: 100V
C116 C117 = MDT_C:C; BOM: EXCLUDE; PACKAGE: 1812; VOLTAGE: 100V
C118 C119 = MDT_C:C; BOM: EXCLUDE; PACKAGE: 1812; VOLTAGE: 250V
C120 = MDT_C:C; BOM: INCLUDE; PACKAGE: 1812; VOLTAGE: 250V
C301 C305 C306 = MDT_C:C; BOM: INCLUDE; PACKAGE: 0805; VOLTAGE: 25V
C302 C303 = MDT_C:C; BOM: EXCLUDE; PACKAGE: 0805; VOLTAGE: 25V
C401 = MDT_C:CPOL; BOM: INCLUDE; DIALECTRIC: ELEC; PARTNO: MAL225638332E3; SIZE: 25DX37L; TOL: +/-20%; VENDOR: Vishay; VOLTAGE: 63V
C402 C405 C408 C411-C413 = MDT_C:C; BOM: INCLUDE; DIALECTRIC: X7S; PACKAGE: 2220; PARTNO: CGA9N3X7S2A106M230KE; TOL: 20%; VOLTAGE: 100V
C403 C404 = MDT_C:C; BOM: INCLUDE; DIALECTRIC: X7S; PACKAGE: 1210; VOLTAGE: 50V
C406 C407 = MDT_C:C; BOM: INCLUDE; DIALECTRIC: X7R; PACKAGE: 1206; VOLTAGE: 50V
C409 C410 = MDT_C:CPOL; BOM: INCLUDE; DIALECTRIC: ELEC; PARTNO: 860010773010; SIZE: 6.3DX12.5L; TOL: +/-20%; VENDOR: Wurth; VOLTAGE: 63V
D401 = MDT_Diode:D-SCHOTTKY; BOM: INCLUDE; CURRENT: 8A; DEVICE: SK810L-TP; PACKAGE: SMC; PARTNO: SK810L-TP; VOLTAGE: 100V
D402 = MDT_Diode:D-ZENER; BOM: INCLUDE; DEVICE: 1N5355B-TP; PACKAGE: DO-15; PARTNO: 1N5355B-TP; POWER: 5W; VOLTAGE: 18V
F401 = MDT_FUSE:FUSE_2P; BOM: INCLUDE; PARTNO: 02540121Z
H401-H404 = holes:MOUNT-PAD-SQUARE: MOUNTING PAD, square; BOM: EXCLUDE
J101 J102 J301 J302 = MDT_CON:COAX; BOM: INCLUDE; DESCRIPTION: CONN BNC JACK STR 50OHM EDGE MNT; PARTNO: 112640; VENDOR: Amphenol
J401 = MDT_CON:HDR_2X1; BOM: INCLUDE; DESCRIPTION: TERM BLK 2POS SIDE ENTRY 5MM PCB; PARTNO: 282836-1; PINS: 2x1; VENDOR: TE
J402 = MDT_CON:KK_PCFAN; BOM: INCLUDE; DESCRIPTION: CONN HEADER VERT 4POS 2.54MM; PARTNO: 47053-1000; VENDOR: MOLEX
JP301 JP302 = pinhead:PINHD-1X2: PIN HEADER
L101 L102 L201 L202 = MDT_L:L_CHIP; BOM: INCLUDE; CORE: AIR; DCR: 0.16; IDC: 1A; PACKAGE: 1008; PARTNO: 1008CS-470XJLC; TOL: 5%
L103 L104 L401 = MDT_L:L; BOM: INCLUDE; CURRENT: 10.5A; DEVICE: DR127-3R3-R; ESR: 5.67m; PARTNO: DR127-3R3-R; TOL: 20%
L402 = MDT_L:L; BOM: INCLUDE; CURRENT: 4.0A; DEVICE: DR127-220-R; ESR: 39.1m; PARTNO: DR127-220-R; TOL: 20%
LED301 = MDT_Diode:LED; BOM: INCLUDE; BRIGHTNESS: 5.7mcd; COLOR: YELLOW; CURRENT: 10mA; PACKAGE: T-1 3/4; PARTNO: HLMP-3401-E0002; VENDOR: BROADCOM
LED401 LED402 = MDT_Diode:LED; BOM: INCLUDE; BRIGHTNESS: 10.6mcd; COLOR: GREEN; CURRENT: 10mA; PACKAGE: T-1 3/4; PARTNO: HLMP-3962-F0002; VENDOR: BROADCOM
Q101 Q102 Q201 Q202 = MDT_TRANS:MOSFET_N; BOM: INCLUDE; CURRENT: 9A; DESCRIPTION: MOSFET N-CH 200V 9A TO220AB; DEVICE: IRF630; PACKAGE: TO-220; PARTNO: IRF630; VENDOR: STM; VOLTAGE: 200V
Q301 = MDT_TRANS:MOSFET_N; BOM: INCLUDE; CURRENT: 0.17A; DESCRIPTION: MOSFET N-CH 100V 170MA SOT23-3; DEVICE: BSS123; PACKAGE: SOT23-3; PARTNO: BSS123-7-F; VENDOR: Diodes Inc; VOLTAGE: 100V
Q302 = MDT_TRANS:PNP; BOM: INCLUDE; CURRENT: 0.2A; DESCRIPTION: TRANS PNP 40V 200MA TO236AB; DEVICE: MMBT3906; PACKAGE: SOT23-3; PARTNO: PMBT3906,215; VENDOR: Nexperia; VOLTAGE: 40V
Q303 = MDT_TRANS:NPN; BOM: INCLUDE; CURRENT: 0.2A; DESCRIPTION: TRANS NPN 40V 200MA TO236AB; DEVICE: MMBT3904; PACKAGE: SOT23-3; PARTNO: MMBT3904,215; VENDOR: Nexperia; VOLTAGE: 40V
R101 R108 R110 R132 R207 R209 R307 R309 R314 R406 R407 = MDT_R:R; BOM: INCLUDE; PACKAGE: 0805
R102 R103 R106 R107 R109 R111 R201 R202 R205 R206 R208 R210 = MDT_R:R; BOM: INCLUDE; PACKAGE: 1206
R104 R105 R203 R204 R402-R405 = MDT_R:R90; BOM: INCLUDE; PACKAGE: 1206
R112 R113 R116 R117 R211 R212 R215 R216 R311 = MDT_R:R; BOM: EXCLUDE; PACKAGE: 0805
R114 R115 R130 R131 R213 R214 R229 R230 R302-R306 R308 R310 R312 R315-R317 R408 = MDT_R:R90; BOM: INCLUDE; PACKAGE: 0805
R118-R121 R217-R220 = MDT_R:R90; BOM: INCLUDE; PACKAGE: 2512
R122-R129 R221-R228 = MDT_R:R; BOM: INCLUDE; PACKAGE: 2512
R301 = MDT_R:RTRIM; BOM: INCLUDE; DESCRIPTION: TRIMMER 10K OHM 0.5W PC PIN TOP; PARTNO: 3299W-1-103LF; POWER: 0.5W; TOL: 10%; VENDOR: Bourns
R313 = MDT_R:R90; BOM: EXCLUDE; PACKAGE: 0805
R401 = MDT_R:R90; BOM: INCLUDE; PACKAGE: AXIAL; PARTNO: PAC300001008FAC000; POWER: 3W; TOL: 1%; VENDOR: Vishay
T101 T102 = MDT_TRAFO:HP4_TRAFO; BOM: INCLUDE; CURRENT: 1.88A; ISAT: 1A; PARTNO: HP4-0140LB; RATIO: 1:1:1:1:1:1
TP1 TP3 TP7 TP9 TP11-TP19 = MDT_CON:PROBE_TP; BOM: EXCLUDE; DESCRIPTION: Probe testpoint 5mm
TP2 TP4-TP6 TP8 TP10 = MDT_CON:PROBE_TP; BOM: EXCLUDE; DESCRIPTION: Probe testpoint 7.5mm
U301 = 74xx-little-us:74*1G14: Single Schmitt-Trigger Inverter Gate; BOM: INCLUDE; DESCRIPTION: IC INVERT SCHMITT 1CH 1-IN SOT25; PACKAGE: SOT23-5; PARTNO: 74AHC1G14QW5-7; VENDOR: Diodes Inc
U302 = MDT_IC:OPAMP_QUAD; BOM: INCLUDE; DESCRIPTION: IC OPAMP GP 4 CIRCUIT 14SOIC; PARTNO: TLV274ID; VENDOR: Texas Instruments
U401 = MDT_IC:LDO_3TERM; BOM: INCLUDE; DESCRIPTION: IC REG LINEAR 12V 500MA TO220AB; PACKAGE: TO220; PARTNO: MC78M12CTG; VENDOR: ONSEMI
U402 = MDT_IC:LDO_3TERM; BOM: INCLUDE; DESCRIPTION: IC REG LINEAR 5V 500MA TO220AB; PACKAGE: TO220; PARTNO: MC78M05CTG; VENDOR: ONSEMI
X402 = MDT_HEATSINK:HEATSINK_OMNI_DUAL; BOM: INCLUDE; DESCRIPTION: HEATSINK TO-247 TO-264 TO-220; PARTNO: OMNI-UNI-30-75-D; VENDOR: Wakefield-Vette

## Net classes
1 32W_20S: width 0.813 mm, drill 0.6 mm, clearance 0.508 mm
2 32W_30S: width 0.813 mm, drill 0.6 mm, clearance 0.762 mm
3 50W_30S: width 1.27 mm, drill 0.6 mm, clearance 0.762 mm

## Board
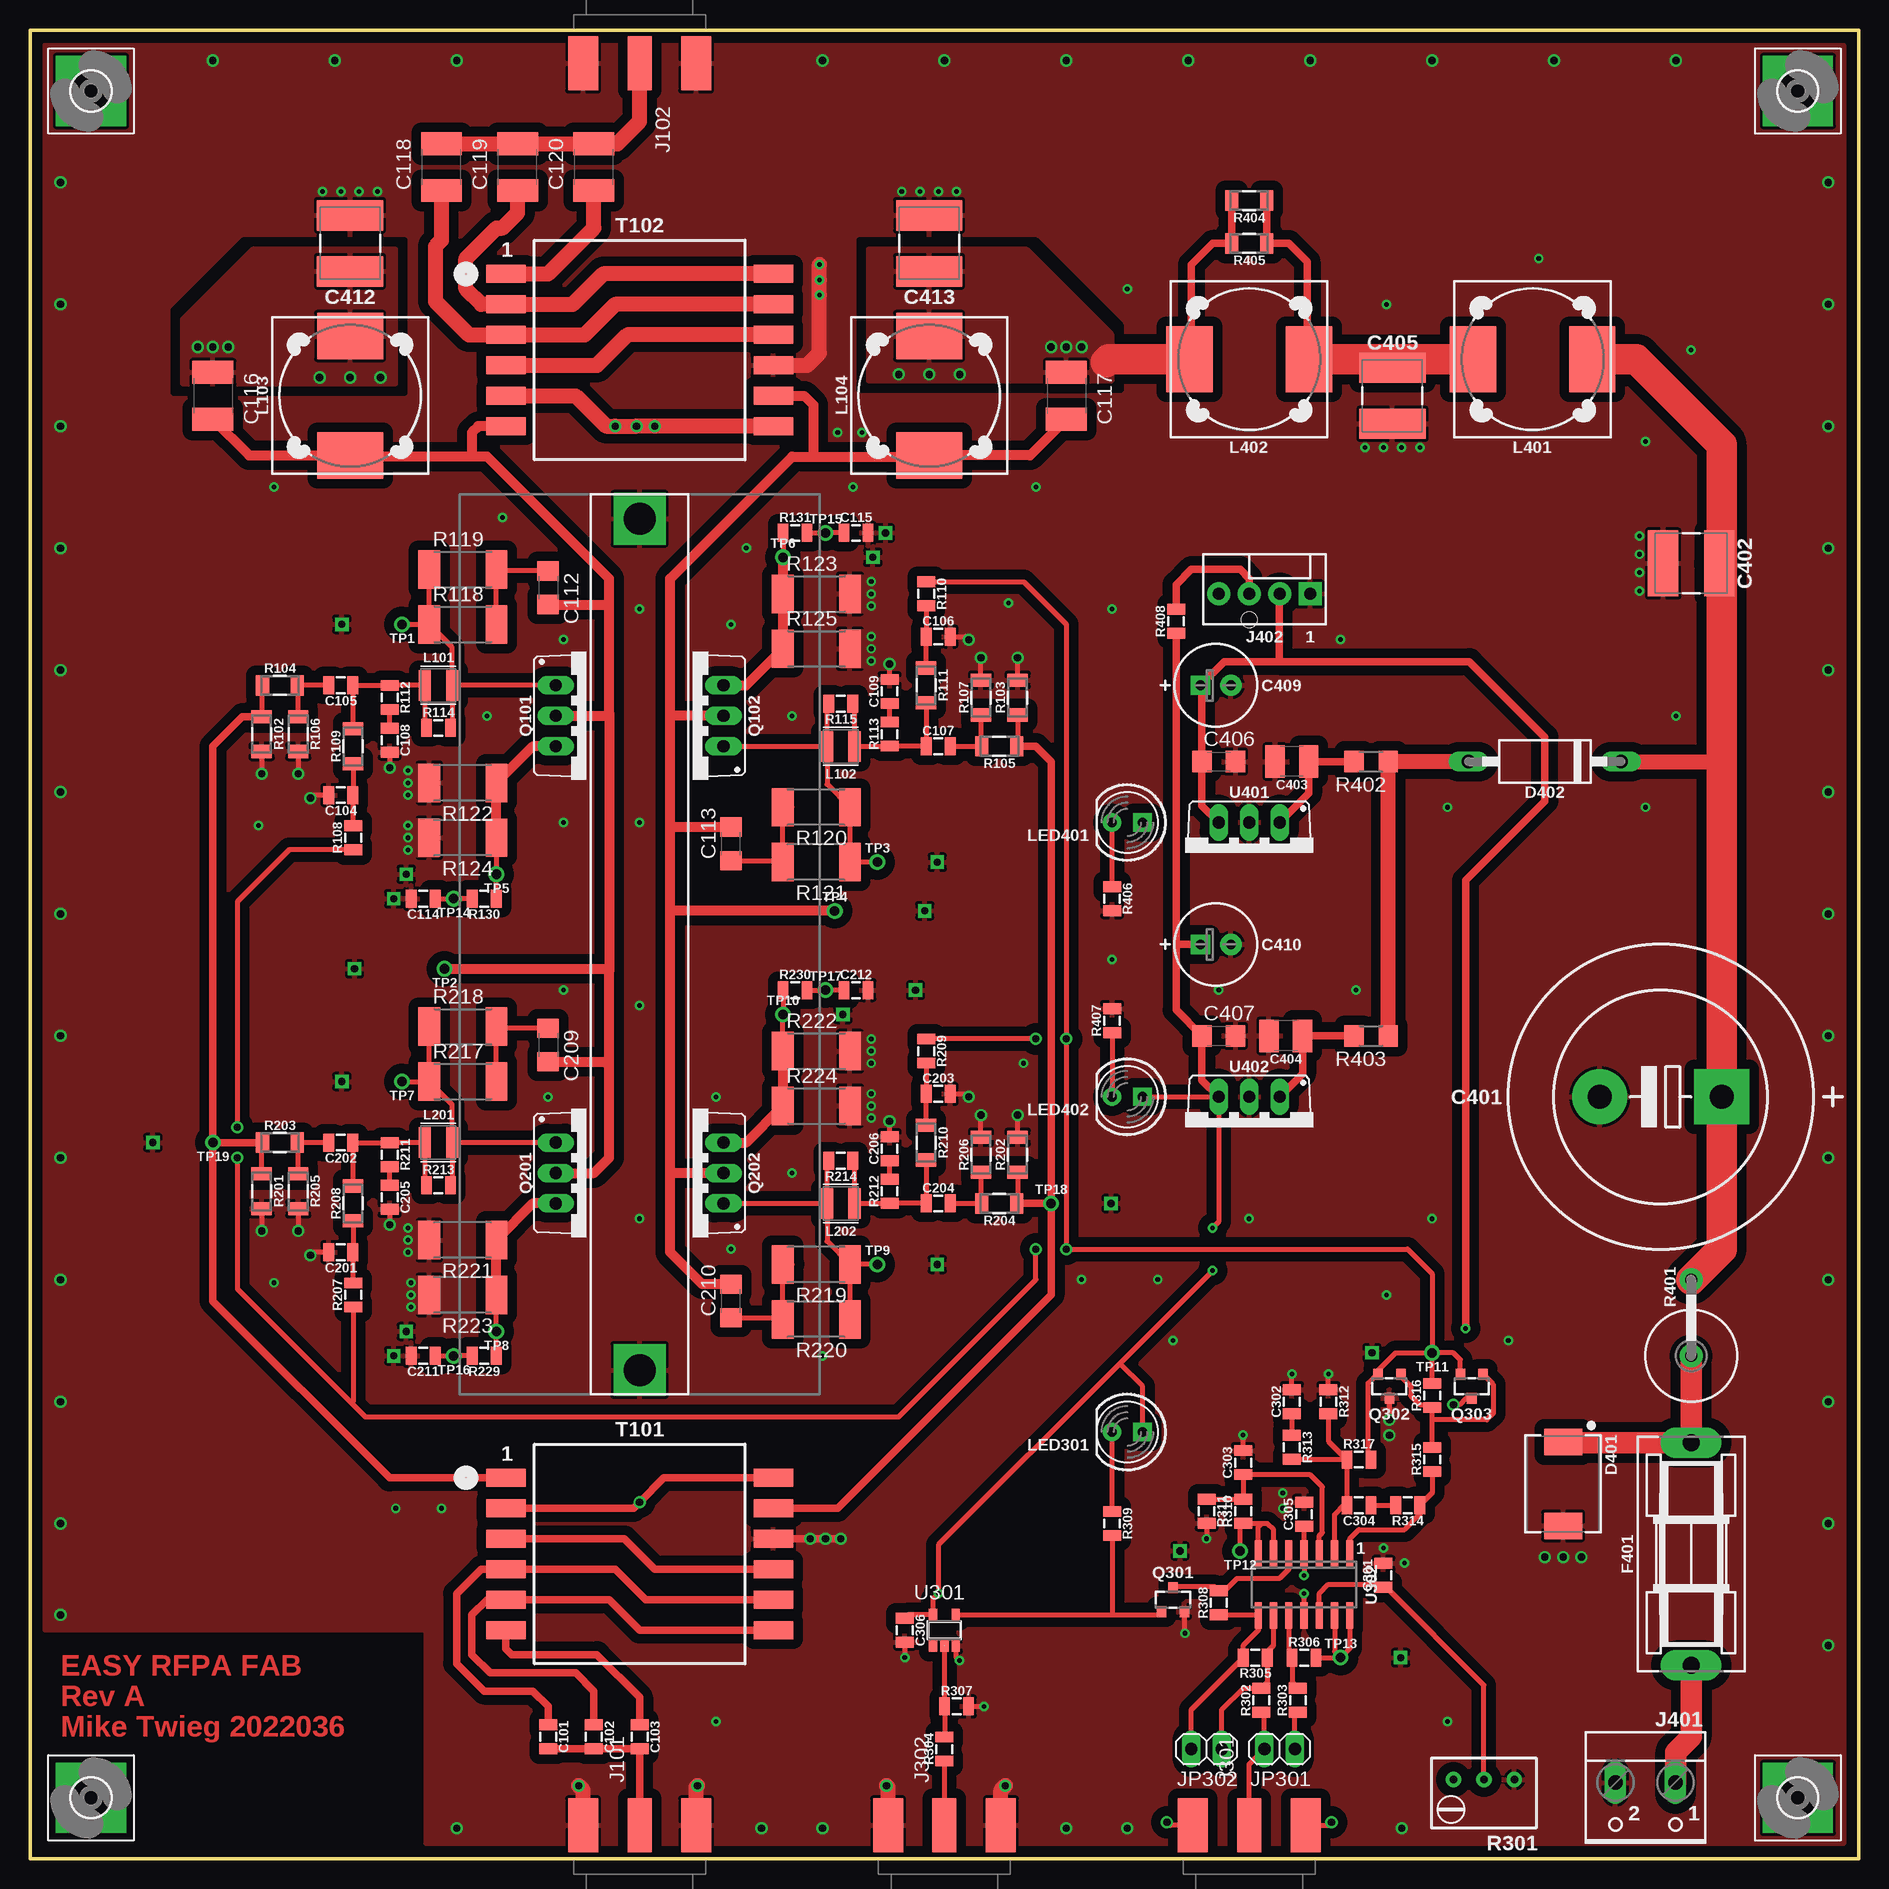
[diagram p4: board, top side]
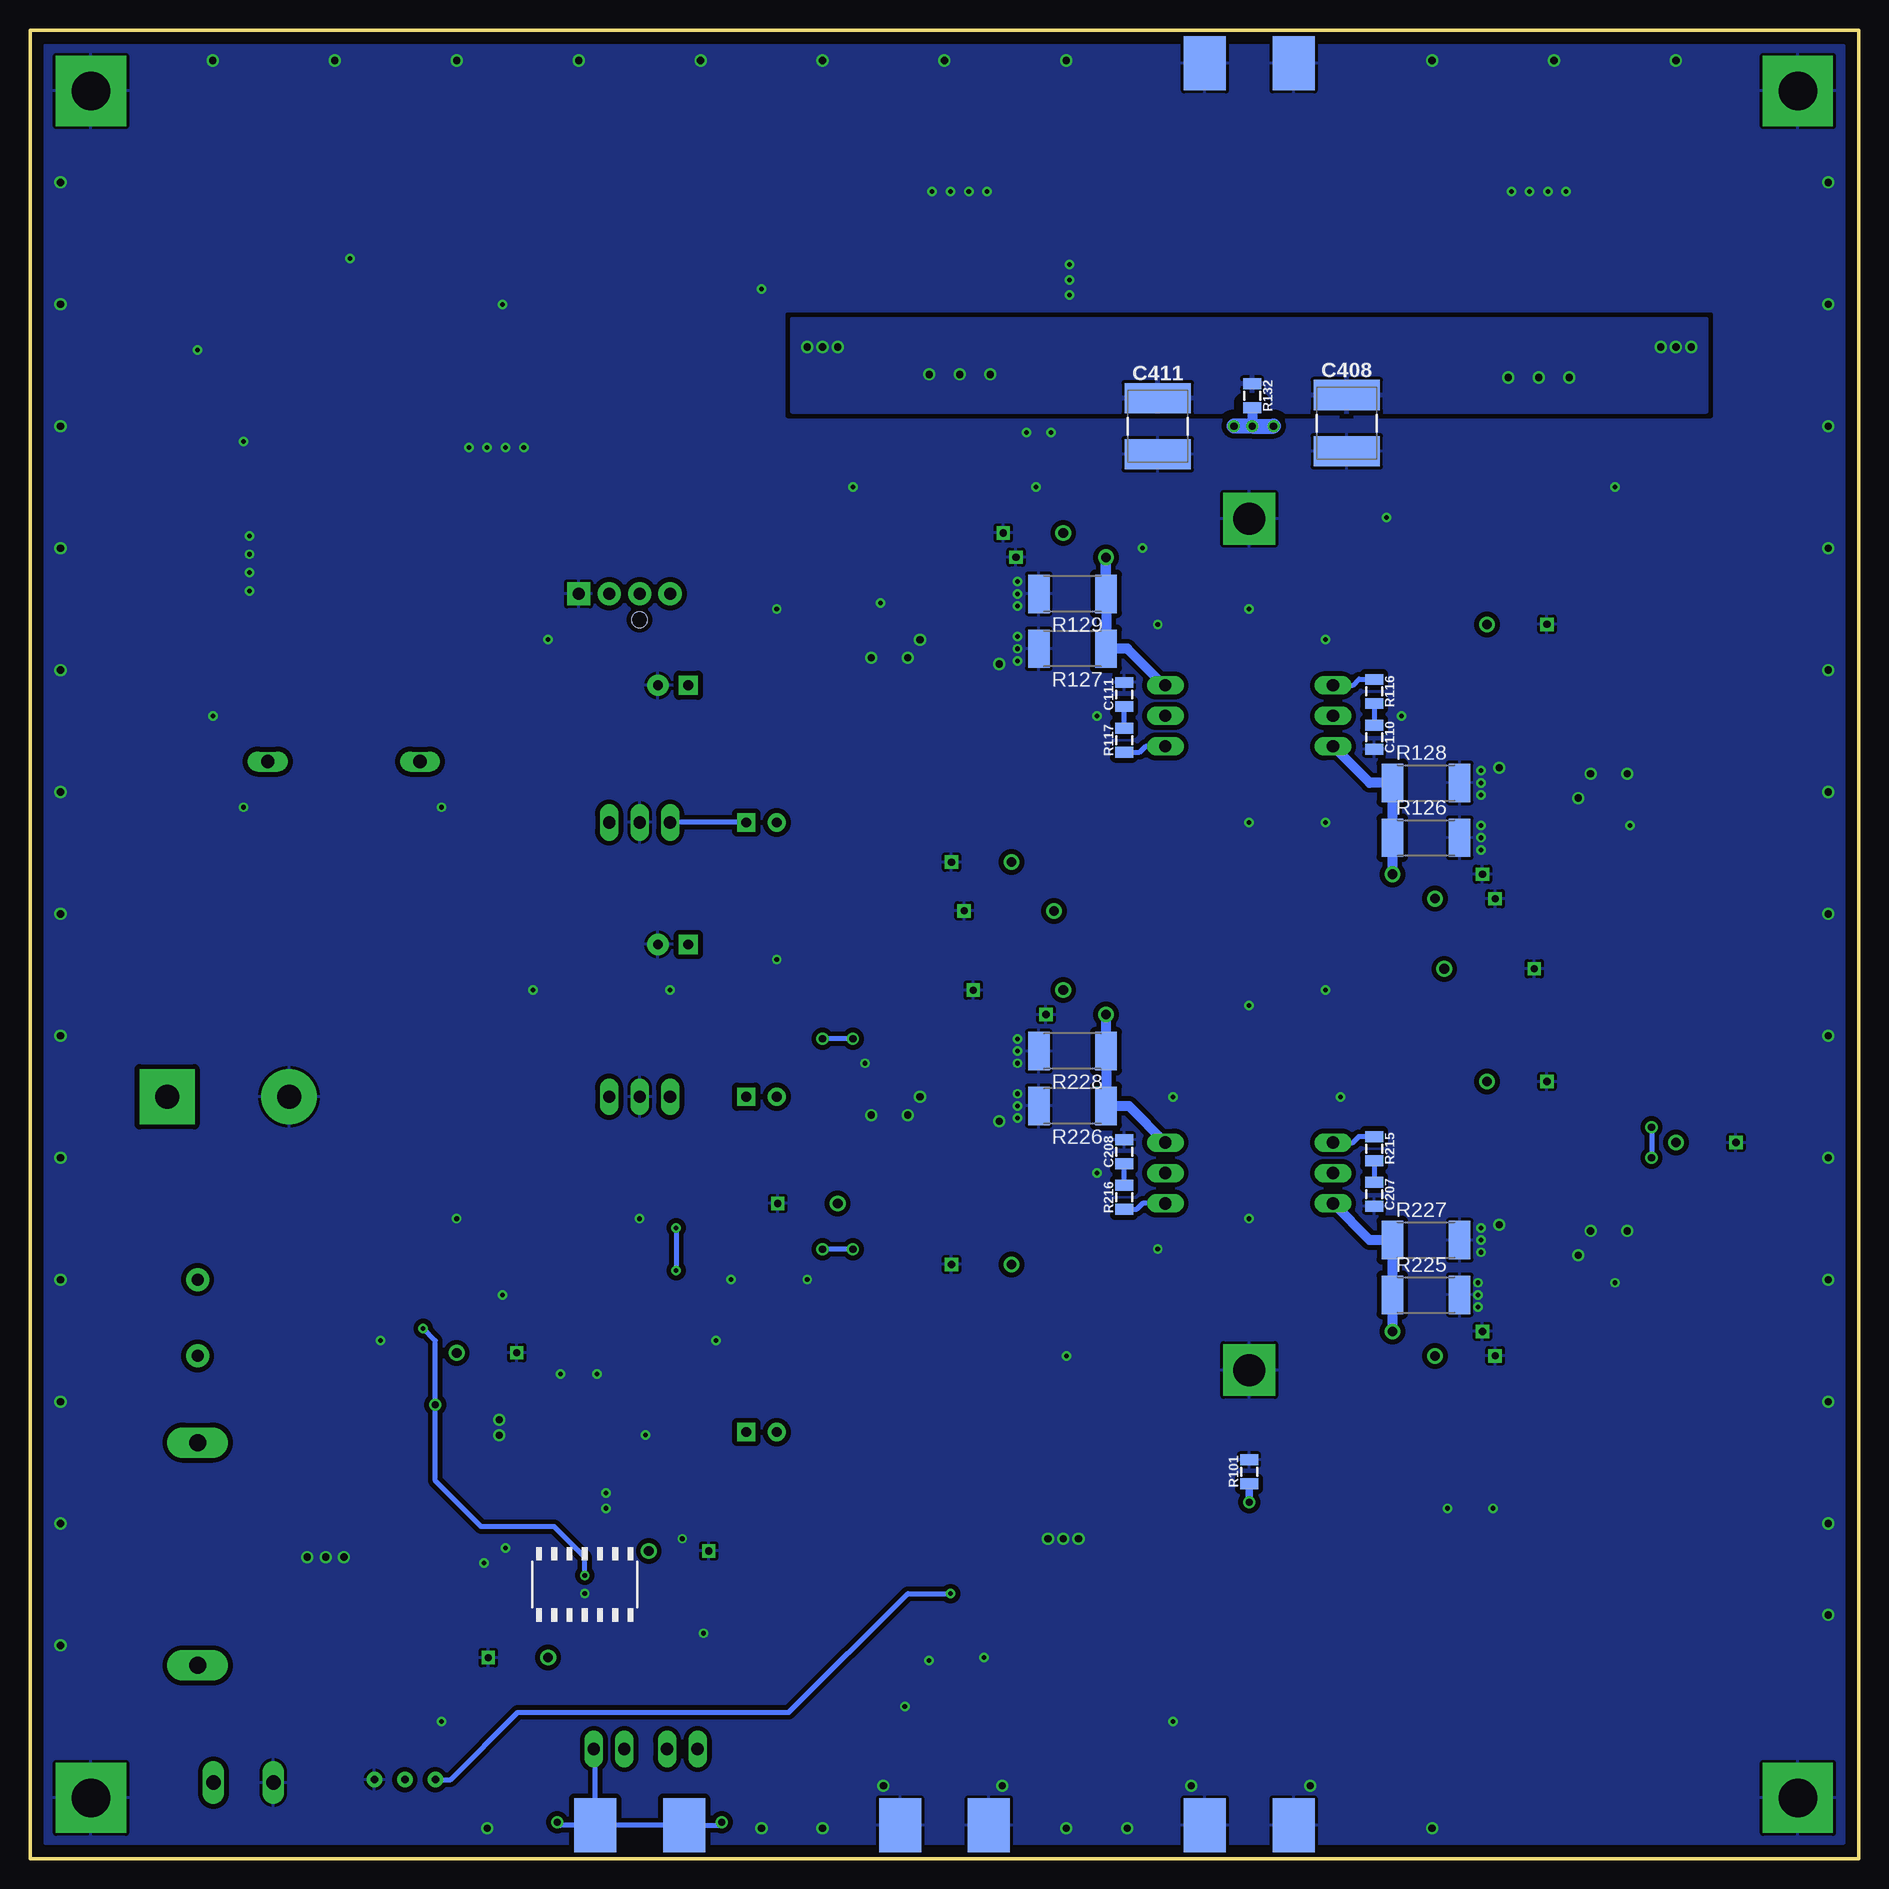
[diagram p5: board, bottom side, seen from below]

Size 152.4 x 152.4 mm. Coordinates in mm from the lower left corner, seen from the top.
Outline: 0,0 152.4,0 152.4,152.4 0,152.4 0,0
Copper layers (1+2*15+16): Top 0.035mm / dielectric 1.5mm / Route2 0.035mm / dielectric 0.15mm / Route15 0.035mm / dielectric 0.2mm / Bottom 0.035mm
Design rules "default *": minimum track width 10mil, minimum drill 15mil, track to track 8mil, track to pad 8mil, pad to pad 8mil, via to via 8mil, smd to smd 8mil, copper to edge 10mil, drill to drill 8mil, minimum pad ring 10mil, minimum via ring 8mil, stop-mask expansion 4mil, vias tented up to drill 0mil, thermal gap 10mil

### Footprints (pad centres in the part's own frame; a part is rotated, then mirrored left to right if it is on the bottom)
0805_IPC-7351B = smd 0.9 x 1.5: 1 -1,0; 2 1,0
C1206 = smd 1.6 x 1.8: 1 -1.4,0; 2 1.4,0
C1812 = smd 1.9 x 3.4: 1 -1.95,0; 2 1.95,0
EB25D = drill 2.007 pad 4.597 square: + -5.08,0 | drill 2.007 pad 4.597: - 5.08,0
C2220_CKG57N = smd 2.53 x 5.51: 1 -2.335,0; 2 2.335,0
C1210 = smd 1.6 x 2.7: 1 -1.4,0; 2 1.4,0
E2,5-7 = drill 0.813 pad 1.6 square: + -1.27,0 | drill 0.813 pad 1.778: - 1.27,0
DO-214AB(SMC) = smd 2.2 x 3.15: A 3.5,0; K -3.5,0
DO15-12 = drill 1.118 long: A 6.35,0; C -6.35,0
02540121Z = drill 1.4 pad 2.54 long: 1 -9.271,0; 2 9.271,0
3,2-PAD-SQUARE = drill 3.2 pad 5.842 square: B3,2 0,0
BNC_EDGE = smd 4.5 x 2: C 0.25,0 | smd 4.5 x 2.5: G1 0.25,4.7; G4 0.25,-4.7 | smd 4.5 x 3.5 bottom: G2 0.25,3.7; G3 0.25,-3.7
W237-02 = drill 1.194 long: 1 -2.5,-1.27; 2 2.5,-1.27
47053-1000 = drill 1 pad 1.93 square: 1 3.81,0 | drill 1 pad 1.93: 2 1.27,0; 3 -1.27,0; 4 -3.81,0 | hole 1.3: -1.27,-2.16
1X02 = drill 1.016 long: 1 -1.27,0; 2 1.27,0
L1008 = smd 1.02 x 2.54: 1 -1.145,0; 2 1.145,0
DR127 = smd 3.85 x 5.5: 1 -4.975,0; 2 4.975,0
LED5MM = drill 0.813 pad 1.524 square: A -1.27,0 | drill 0.813 pad 1.524: K 1.27,0
TO220BV = drill 1.016 long: D 0,-2.54; G -2.54,-2.54; S 2.54,-2.54
SOT23R_INFINEON = smd 0.8 x 0.9: 1 -0.95,-1; 2 0.95,-1; 3 0,1
1206_IPC-7351B = smd 1.1 x 1.7: 1 -1.45,0; 2 1.45,0
R2512 = smd 1.8 x 3.2: 1 -2.8,0; 2 2.8,0
RTRIM3299W = drill 0.61 pad 1.27: 1 1.27,-2.54; 2 1.27,0; 3 1.27,2.54
P0817V = drill 1.016 pad 1.905: 1 -5.08,0; 2 1.27,0
R1206 = smd 1.6 x 1.803: 1 -1.422,0; 2 1.422,0
HP4 = smd 3.3 x 1.5: 1 -11.15,6.35; 2 -11.15,3.81; 3 -11.15,1.27; 4 -11.15,-1.27; 5 -11.15,-3.81; 6 -11.15,-6.35; 7 11.15,-6.35; 8 11.15,-3.81; 9 11.15,-1.27; 10 11.15,1.27; 11 11.15,3.81; 12 11.15,6.35
PROBE_TP_5MM = drill 0.6 square: GND 5,0 | drill 0.8: TP 0,0
PROBE_TP_7P5MM = drill 0.6 square: GND 7.5,0 | drill 0.8: TP 0,0
SOT23-5 = smd 0.69 x 0.99: 1 -0.95,-1.29; 2 0,-1.29; 3 0.95,-1.29; 4 0.95,1.3; 5 -0.95,1.3
SO14 = smd 0.6 x 2.2: 1 -3.81,-2.6; 2 -2.54,-2.6; 3 -1.27,-2.6; 4 0,-2.6; 5 1.27,-2.6; 6 2.54,-2.6; 7 3.81,-2.6; 8 3.81,2.6; 9 2.54,2.6; 10 1.27,2.6; 11 0,2.6; 12 -1.27,2.6; 13 -2.54,2.6; 14 -3.81,2.6
TO220BV' = drill 1.016 long: 1 -2.54,-2.54; 2 0,-2.54; 3 2.54,-2.54
OMNI-UNI-30-75-D = drill 2.667 pad 4.318 square: P1 0,35.47; P2 0,-35.47

### Placement (x,y rotation side)
C101  43.18,10.16 270 top
C102  46.99,10.16 270 top
C103  50.8,10.16 270 top
C104  25.91,88.65 180 top
C105  25.91,97.79 180 top
C106  75.69,101.85 0 top
C107  75.69,92.71 0 top
C108  29.97,93.22 270 top
C109  71.63,97.28 90 top
C110  40.39,93.47 270 bottom
C111  61.21,97.03 90 bottom
C112  43.18,105.92 270 top
C113  58.42,84.58 90 top
C114  32.77,80.01 180 top
C115  68.83,110.49 0 top
C116  15.24,121.92 270 top
C117  86.36,121.92 270 top
C118  34.29,140.97 90 top
C119  40.64,140.97 90 top
C120  46.99,140.97 90 top
C201  25.91,50.55 180 top
C202  25.91,59.69 180 top
C203  75.69,63.75 0 top
C204  75.69,54.61 0 top
C205  29.97,55.12 270 top
C206  71.63,59.18 90 top
C207  40.39,55.37 270 bottom
C208  61.21,58.93 90 bottom
C209  43.18,67.82 270 top
C210  58.42,46.48 90 top
C211  32.77,41.91 180 top
C212  68.83,72.39 0 top
C301  112.78,23.62 90 top
C302  105.16,38.1 90 top
C303  101.09,33.02 90 top
C304  110.74,29.46 180 top
C305  106.17,28.7 90 top
C306  72.9,19.05 270 top
C401  135.89,63.5 180 top
C402  138.43,107.95 180 top
C403  105.16,91.44 180 top
C404  104.65,68.58 180 top
C405  113.54,121.92 270 top
C406  99.06,91.44 0 top
C407  99.06,68.58 0 top
C408  42.67,119.63 270 bottom
C409  98.81,97.79 0 top
C410  98.81,76.2 0 top
C411  58.42,119.38 270 bottom
C412  26.67,134.62 90 top
C413  74.93,134.62 90 top
D401  127.76,31.24 270 top
D402  126.24,91.44 180 top
F401  138.43,25.4 90 top
H401  5.08,5.08 0 top
H402  147.32,5.08 0 top
H403  147.32,147.32 0 top
H404  5.08,147.32 0 top
J101  50.8,2.54 90 top
J102  50.8,149.86 270 top
J301  101.6,2.54 90 top
J302  76.2,2.54 90 top
J401  134.62,5.08 180 top
J402  102.87,105.41 0 top
JP301  104.14,9.14 180 top
JP302  98.04,9.14 180 top
L101  34.04,97.79 0 top
L102  67.56,92.71 180 top
L103  26.67,121.92 90 top
L104  74.93,121.92 90 top
L201  34.04,59.69 0 top
L202  67.56,54.61 180 top
L401  125.22,124.97 180 top
L402  101.6,124.97 180 top
LED301  91.44,35.56 180 top
LED401  91.44,86.36 180 top
LED402  91.44,63.5 180 top
Q101  46.35,95.25 270 top
Q102  55.24,95.25 90 top
Q201  46.35,57.15 270 top
Q202  55.24,57.15 90 top
Q301  95.25,21.59 0 top
Q302  113.28,39.37 180 top
Q303  120.14,39.37 180 top
R101  50.8,32.26 90 bottom
R102  19.3,93.73 270 top
R103  82.3,96.77 90 top
R104  20.83,97.79 0 top
R105  80.77,92.71 180 top
R106  22.35,93.73 270 top
R107  79.25,96.77 90 top
R108  26.92,85.09 90 top
R109  26.92,92.71 90 top
R110  74.68,105.41 270 top
R111  74.68,97.79 270 top
R112  29.97,96.77 270 top
R113  71.63,93.73 90 top
R114  34.04,94.23 0 top
R115  67.56,96.27 180 top
R116  40.39,97.28 270 bottom
R117  61.21,93.22 90 bottom
R118  36.07,102.87 0 top
R119  36.07,107.44 0 top
R120  65.53,87.63 180 top
R121  65.53,83.06 180 top
R122  36.07,89.66 180 top
R123  65.53,105.41 0 top
R124  36.07,85.09 180 top
R125  65.53,100.84 0 top
R126  36.07,85.09 0 bottom
R127  65.53,100.84 180 bottom
R128  36.07,89.66 0 bottom
R129  65.53,105.41 180 bottom
R130  37.85,80.01 180 top
R131  63.75,110.49 0 top
R132  50.55,121.92 270 bottom
R201  19.3,55.63 270 top
R202  82.3,58.67 90 top
R203  20.83,59.69 0 top
R204  80.77,54.61 180 top
R205  22.35,55.63 270 top
R206  79.25,58.67 90 top
R207  26.92,46.99 90 top
R208  26.92,54.61 90 top
R209  74.68,67.31 270 top
R210  74.68,59.69 270 top
R211  29.97,58.67 270 top
R212  71.63,55.63 90 top
R213  34.04,56.13 0 top
R214  67.56,58.17 180 top
R215  40.39,59.18 270 bottom
R216  61.21,55.12 90 bottom
R217  36.07,64.77 0 top
R218  36.07,69.34 0 top
R219  65.53,49.53 180 top
R220  65.53,44.96 180 top
R221  36.07,51.56 180 top
R222  65.53,67.31 0 top
R223  36.07,46.99 180 top
R224  65.53,62.74 0 top
R225  36.07,46.99 0 bottom
R226  65.53,62.74 180 bottom
R227  36.07,51.56 0 bottom
R228  65.53,67.31 180 bottom
R229  37.85,41.91 180 top
R230  63.75,72.39 0 top
R301  121.16,5.33 90 top
R302  102.62,13.21 90 top
R303  105.66,13.21 90 top
R304  76.2,9.14 90 top
R305  102.11,16.76 180 top
R306  106.17,16.76 0 top
R307  77.22,12.7 0 top
R308  99.06,21.34 90 top
R309  90.17,27.94 270 top
R310  101.09,28.96 90 top
R311  98.04,28.96 270 top
R312  108.2,38.1 270 top
R313  105.16,34.29 270 top
R314  114.81,29.46 180 top
R315  116.84,33.27 90 top
R316  116.84,38.61 90 top
R317  110.74,33.27 0 top
R401  138.43,46.99 90 top
R402  111.76,91.44 180 top
R403  111.76,68.58 180 top
R404  101.6,138.18 180 top
R405  101.6,134.62 180 top
R406  90.17,80.01 270 top
R407  90.17,69.85 90 top
R408  95.5,103.12 90 top
T101  50.8,25.4 0 top
T102  50.8,125.73 0 top
TP1  30.99,102.87 180 top
TP2  34.54,74.17 180 top
TP3  70.61,83.06 0 top
TP4  67.06,78.99 0 top
TP5  38.86,82.04 180 top
TP6  62.74,108.46 0 top
TP7  30.99,64.77 180 top
TP8  38.86,43.94 180 top
TP9  70.61,49.53 0 top
TP10  PROBE_TPTP_5MM  [PROBE_TP_5MM]  62.74,70.36 0 top
TP11  116.84,42.16 180 top
TP12  100.84,25.65 180 top
TP13  109.22,16.76 0 top
TP14  35.31,80.01 180 top
TP15  66.29,110.49 0 top
TP16  35.31,41.91 180 top
TP17  PROBE_TPTP_7P5MM  [PROBE_TP_7P5MM]  66.29,72.39 0 top
TP18  85.09,54.61 0 top
TP19  15.24,59.69 180 top
U301  76.2,19.05 0 top
U302  106.17,22.86 180 top
U401  LDO_3TERMMC78M12CTGTO220_VERT  [TO220BV']  101.6,83.82 180 top
U402  LDO_3TERMMC78M05CTGTO220_VERT  [TO220BV']  101.6,60.96 180 top
X402  50.8,76.2 0 top

### Tracks (layer width: path | path; a pad name or v marks a point on that pad's centre or on a via)
+5V  (via drill 0.38)
  Top 0.406: C306.1 73.2,20.35 U301.5 75.25,21.66 v75.69,22.1 75.69,26.16 90.81,41.27 | v98.55,52.58 99.06,53.09 U402.3 LED402.A | v98.55,49.02 90.81,41.27 | LED301.A 92.71,39.37 90.81,41.27
  Top 0.61: U402.3 97.66,64.9 C407.1 95.5,70.74 95.5,76.2 | R408.1 95.5,76.2 | C410.+ 95.5,76.2
  Bottom 0.406: R301.3 117.35,6.6 111.76,12.19 89.15,12.19 79.25,22.1 v75.69,22.1 | v98.55,52.58 v98.55,49.02
+12V  (via drill 0.38, 0.6)
  Top 0.406: C305.1 U302.4 v106.17,23.62 | v118.62,37.85 119.13,37.85 119.65,38.37 Q303.3
  Top 0.61: U401.3 97.66,87.76 C406.1 97.66,97.67 C409.+ 99.52,99.77 104.09,99.77 | 104.09,99.77 104.09,105.36 J402.2 | v119.63,44.2 119.63,81.53 126.24,88.14 126.24,93.47 119.94,99.77 104.09,99.77
  Bottom 0.406: v106.17,23.62 106.17,25.15 108.71,27.69 114.81,27.69 118.62,31.5 v118.62,37.85 118.62,43.18 v119.63,44.2 | LED401.A U401.3
ABN1
  Top 0.406: R202.1 82.3,54.68 R204.1 | R103.1 82.3,92.78 R105.1
  Top 0.61: R105.1 83.82,92.71 85.09,91.44 TP18.TP | TP18.TP 85.09,46.99 67.31,29.21 T101.11 | R204.1 TP18.TP
ABP1
  Top 0.406: R102.1 19.3,97.72 R104.1 | R201.1 19.3,59.62 R203.1
  Top 0.61: TP19.TP 15.24,92.71 17.71,95.18 R102.1 | TP19.TP 15.24,46.48 29.97,31.75 T101.1 | R203.1 TP19.TP
AN2
  Top 0.406: C107.2 R105.2 79.25,92.78 R107.1
AN3
  Top 0.406: R115.1 68.71,96.12 L102.1 71.61,92.71 R113.1 71.64,92.71 C107.1 74.68,92.73 R111.2
AN4
  Top 0.406: Q102.G L102.2 | L102.2 66.42,96.12 R115.2 | L102.2 66.42,89.54 R120.1 R121.1 TP3.TP
  Bottom 0.406: R117.1 59.93,92.22 59.44,92.71 Q102.G
AN5
  Top 0.406: R131.1 62.75,108.47 TP6.TP
  Top 0.813: Q102.S 59.68,97.79 R127.1 R129.1 TP6.TP
  Bottom 0.813: R129.1 62.75,105.43 62.75,108.44 TP6.TP R129.1 R127.1 60.96,100.84 57.91,97.79 Q102.S
AN6
  Top 0.406: R131.2 TP15.TP C115.1
AP2
  Top 0.406: C105.2 R104.2 22.35,97.72 R106.1
AP3
  Top 0.406: R114.1 32.89,94.38 L101.1 29.99,97.79 R112.1 29.96,97.79 C105.1 26.92,97.77 R109.2
AP4
  Top 0.406: Q101.G L101.2 | L101.2 35.18,94.38 R114.2 | L101.2 35.18,100.96 R118.1 | R118.1 R119.1 | TP1.TP R118.1
  Bottom 0.406: Q101.G 43.8,97.77 42.18,97.77 41.66,98.3 40.4,98.3 R116.1
AP5
  Top 0.406: R126.1 TP5.TP 38.85,82.03 R130.1
  Top 0.813: R126.1 R128.1 41.92,92.71 Q101.S
  Bottom 0.813: TP5.TP R126.1 R128.1 40.77,89.66 Q101.S
AP6
  Top 0.406: C114.1 TP14.TP R130.2
BN2
  Top 0.406: C204.2 R204.2 79.25,54.68 R206.1
BN3
  Top 0.406: R214.1 68.71,58.02 L202.1 71.61,54.61 R212.1 71.64,54.61 C204.1 74.68,54.63 R210.2
BN4
  Top 0.406: Q202.G L202.2 | L202.2 66.42,58.02 R214.2 | R219.1 R220.1 | L202.2 66.42,51.44 R219.1 | TP9.TP R219.1
  Bottom 0.406: R216.1 60.18,54.12 59.69,54.61 Q202.G
BN5
  Top 0.406: R228.1 TP10.TP 62.75,70.37 R230.1
  Top 0.813: Q202.S 59.68,59.69 R226.1 R228.1
  Bottom 0.813: TP10.TP R228.1 R226.1 | R226.1 60.83,62.74 Q202.S
BN6
  Top 0.406: C212.1 TP17.TP R230.2
BP2
  Top 0.406: C202.2 R203.2 22.35,59.62 R205.1
BP3
  Top 0.406: R213.1 32.89,56.28 L201.1 29.99,59.69 R211.1 29.96,59.69 C202.1 26.92,59.67 R208.2
BP4
  Top 0.406: Q201.G L201.2 | L201.2 35.18,56.28 R213.2 | L201.2 35.18,62.86 R217.1 | R217.1 R218.1 | TP7.TP R217.1
  Bottom 0.406: R215.1 41.67,60.18 42.16,59.69 Q201.G
BP5
  Top 0.406: R225.1 38.85,46.97 R229.1 38.85,43.93 TP8.TP
  Top 0.813: R225.1 R227.1 41.92,54.61 Q201.S
  Bottom 0.813: TP8.TP R225.1 R227.1 40.77,51.56 Q201.S
BP6
  Top 0.406: C211.1 TP16.TP R229.2
DRAINS_NEG
  Top 0.406: 74.83,116.84 74.93,116.84 L104.1
  Top 0.813: Q202.D 53.34,57.15 | 53.34,57.15 53.34,78.74 | 53.34,78.74 53.34,86.11 | 53.34,86.11 53.34,95 | 53.34,95 53.34,106.68 63.5,116.84 65.53,116.84 | C117.2 83.33,116.94 L104.1 | Q102.D 53.59,95.25 53.34,95 | 65.53,116.84 74.83,116.84 | T102.8 64.52,121.92 65.28,121.16 65.28,117.09 65.53,116.84 | TP4.TP 53.59,78.99 53.34,78.74 | C113.2 53.46,85.98 53.34,86.11 | C210.2 56,47.88 53.34,50.55 53.34,57.15
DRAINS_POS
  Top 0.406: 26.77,116.84 26.67,116.84 L103.1
  Top 0.813: Q201.D 46.99,57.15 48.26,58.42 48.26,66.04 | 48.26,66.04 48.26,73.91 | 48.26,95.5 48.26,73.91 | 48.26,95.5 48.26,104.39 | 48.26,104.39 48.26,106.68 38.1,116.84 36.58,116.84 | C116.2 18.27,116.94 L103.1 | Q101.D 48.01,95.25 48.26,95.5 | 36.58,116.84 26.77,116.84 | T102.6 37.34,119.38 36.83,118.87 36.83,117.09 36.58,116.84 | TP2.TP 48.01,74.17 48.26,73.91 | C112.2 48.14,104.52 48.26,104.39 | C209.2 47.88,66.42 48.26,66.04
GBIAS  (via drill 0.6)
  Top 0.406: R110.1 82.82,106.41 86.36,102.87 v86.36,68.33 v86.36,50.8 114.81,50.8 116.84,48.77 TP11.TP | R108.1 26.92,84.07 21.59,84.07 17.27,79.76 v17.27,60.96 | v17.27,58.42 17.27,47.5 26.8,37.97 | 26.8,37.97 27.94,36.83 72.39,36.83 83.82,48.26 v83.82,50.8 | R207.1 26.92,38.1 26.8,37.97 | Q303.2 119.19,41.59 118.62,42.16 TP11.TP | R316.2 TP11.TP | TP11.TP 113.79,42.16 112.33,40.71 Q302.2 112.23,40.37 111.51,39.64 111.51,33.27 R317.2 | v83.82,68.33 74.69,68.33 R209.1
  Bottom 0.406: v83.82,68.33 v86.36,68.33 | v17.27,60.96 v17.27,58.42 | v83.82,50.8 v86.36,50.8
GND  (via drill 0.38, 0.6)
  Top 0.406: C206.2 v71.63,61.47 | R206.2 v79.25,61.98 | R202.2 v82.3,61.98 | C203.2 77.98,63.75 v78.23,63.5 | C205.2 v29.97,52.83 | C201.2 23.62,50.55 v23.37,50.29 | R205.2 v22.35,52.32 | R201.2 v19.3,52.32 | R106.2 v22.35,90.42 | R102.2 v19.3,90.42 | C104.2 23.62,88.65 v23.37,88.39 | C108.2 v29.97,90.93 | R103.2 v82.3,100.08 | R107.2 v79.25,100.08 | C106.2 77.98,101.85 v78.23,101.6 | C109.2 v71.63,99.57 | U302.11 v106.17,22.1 | C303.2 v101.09,35.31 | R311.2 v98.04,26.67 | C305.2 106.17,29.72 | C302.2 v105.16,40.39 | R312.1 v108.2,40.39 | U301.3 77.15,16.83 v77.47,16.51 | R307.2 v79.5,12.7 | Q301.2 96.2,18.86 v96.27,18.8 | C306.2 v72.9,16.76 | Q302.3 v113.28,36.58
  Top 0.61: T101.10 v65.02,26.67 v66.29,26.67 v67.56,26.67
  Top 1.27: T102.9 64.77,124.46 65.79,125.48 v65.79,130.3 v65.79,131.57 v65.79,132.84 | J101.G1 46.1,5.72 v45.72,6.1 | J101.G4 55.5,5.97 v55.63,6.1 | J302.G1 71.5,5.97 v71.37,6.1 | J302.G4 80.9,5.72 v81.28,6.1
  other vias: 104.39,30.48 114.55,24.64 31.5,52.58 31.5,51.56 31.5,50.55 31.75,48.01 31.75,46.99 31.75,45.97 31.5,90.68 31.5,89.66 31.5,88.65 31.5,86.11 31.5,85.09 31.5,84.07 70.1,99.82 70.1,100.84 70.1,101.85 70.1,104.39 70.1,105.41 70.1,106.43 70.1,61.72 70.1,62.74 70.1,63.75 70.1,66.29 70.1,67.31 70.1,68.33 27.43,138.94 28.96,138.94 25.91,138.94 24.38,138.94 134.11,108.71 134.11,110.24 134.11,107.19 134.11,105.66 112.78,117.6 111.25,117.6 114.3,117.6 115.82,117.6 75.69,138.94 77.22,138.94 74.17,138.94 72.64,138.94 126.24,25.15 127.76,25.15 129.29,25.15 104.39,29.21 113.28,35.31 15.24,149.86 25.4,149.86 35.56,149.86 66.04,149.86 76.2,149.86 86.36,149.86 96.52,149.86 106.68,149.86 116.84,149.86 127,149.86 137.16,149.86 2.54,139.7 2.54,129.54 2.54,119.38 2.54,109.22 2.54,99.06 2.54,88.9 2.54,78.74 2.54,68.58 2.54,58.42 2.54,48.26 2.54,38.1 2.54,27.94 2.54,20.32 35.56,2.54 60.96,2.54 66.04,2.54 86.36,2.54 91.44,2.54 114.3,2.54 149.86,139.7 149.86,129.54 149.86,119.38 149.86,109.22 149.86,99.06 149.86,88.9 149.86,78.74 149.86,68.58 149.86,58.42 149.86,48.26 149.86,38.1 149.86,27.94 149.86,17.78 90.17,74.93 99.06,72.39 110.49,72.39 118.11,87.63 116.84,53.34 101.6,53.34 87.63,48.26 93.98,48.26 57.15,11.43 30.48,29.21 34.29,29.21 50.8,86.36 50.8,71.12 50.8,53.34 50.8,104.14 39.37,111.76 58.42,102.87 68.58,114.3 83.82,114.3 20.32,114.3 91.44,130.81 113.03,129.54 125.73,133.35 138.43,125.73 134.62,118.11 109.22,101.6 90.17,104.14 137.16,95.25 134.62,87.63 123.19,43.18 113.03,46.99 95.25,43.18 118.11,11.43 44.45,86.36 44.45,72.39 43.18,63.5 63.5,57.15 58.42,50.8 66.04,41.91 57.15,63.5 63.5,95.25 59.69,109.22 44.45,101.6 38.1,95.25 67.31,118.87 69.34,118.87 112.78,25.91 82.8,66.29 81.53,104.65 19.05,86.11 20.32,48.01
  pour Bottom (isolate 0.406, rank 3): 1.27,1.27 151.13,1.27 151.13,151.13 1.27,151.13
  pour Top (no thermals): 31.24,53.09 34.04,53.09 34.04,50.04 31.24,50.04 30.99,50.29 30.99,52.83
  pour Top (no thermals): 31.5,48.51 34.29,48.51 34.29,45.47 31.5,45.47 31.24,45.72 31.24,48.26
  pour Top (no thermals): 31.24,91.19 34.04,91.19 34.04,88.14 31.24,88.14 30.99,88.39 30.99,90.93
  pour Top (no thermals): 31.24,86.61 34.04,86.61 34.04,83.57 31.24,83.57 30.99,83.82 30.99,86.36
  pour Top (no thermals): 70.36,99.31 67.56,99.31 67.56,102.36 70.36,102.36 70.61,102.11 70.61,99.57
  pour Top (no thermals): 70.36,103.89 67.56,103.89 67.56,106.93 70.36,106.93 70.61,106.68 70.61,104.14
  pour Top (no thermals): 70.36,61.21 67.56,61.21 67.56,64.26 70.36,64.26 70.61,64.01 70.61,61.47
  pour Top (no thermals): 70.36,65.79 67.56,65.79 67.56,68.83 70.36,68.83 70.61,68.58 70.61,66.04
  pour Top (isolate 0.813, rank 3): 151.13,1.27 33.02,1.27 33.02,19.05 1.27,19.05 1.27,151.13 151.13,151.13
N$1
  Top 0.406: U302.1 109.98,26.67 110.74,27.43 114.55,27.43 115.82,28.7 115.82,29.45 R314.1 116.84,30.5 R315.1
N$2
  Top 0.406: R315.2 116.84,36.58 | 116.84,36.58 R316.1 116.84,37.85 115.82,37.85 115.06,38.61 115.06,39.37 114.23,40.2 Q302.1 | 116.84,36.58 121.41,36.58 121.92,37.08 121.92,39.54 Q303.1
N$3
  Top 0.406: U301.2 76.22,17.74 R307.1 76.22,10.16 R304.2
N$4
  Top 0.406: 63.5,87.63 R120.2 R121.2 62.61,83.18 C113.1
N$5
  Top 0.406: R113.2 C109.1
N$6
  Top 0.406: U302.6 103.63,27.43 103.12,27.94 102.62,27.94 | 102.62,27.94 101.11,27.94 R310.1 100.84,27.7 TP12.TP | U302.7 102.36,27.69 102.62,27.94
N$7
  Top 0.406: C304.1 R314.2
N$8
  Top 0.406: R109.1 26.92,88.66 C104.1 26.92,88.63 R108.2
N$9
  Top 0.406: C302.1 R313.1
N$10
  Top 0.406: C108.1 R112.2
N$11
  Bottom 0.406: R116.2 C110.1
N$12
  Top 0.406: R118.2 R119.2 38.99,107.32 C112.1
N$13
  Top 0.406: R111.1 74.68,101.84 C106.1 74.68,101.87 R110.2
N$14
  Top 0.406: U302.2 108.71,28.7 109.46,29.45 109.73,29.45 C304.2 R317.1 | R317.1 105.17,33.27 R313.2 | R312.2 108.2,34.81 R317.1
N$15
  Top 0.406: R311.1 R310.2 C303.1 101.11,32 106.68,32 107.7,30.99 107.7,27.18 107.44,26.92 U302.3
N$16
  Top 0.406: R303.2 105.17,14.7 R306.1 104.9,17.03 U302.10
N$17
  Bottom 0.406: R117.2 C111.1
N$18
  Top 0.406: JP302.2 96.77,12.43 R305.2 101.11,17.8 102.36,19.05 U302.8 102.29,20.34 R308.1
N$19
  Top 0.406: U302.9 103.63,17.78 103.11,17.26 R305.1 103.11,14.7 R302.2 102.6,14.22 101.09,14.22 99.31,12.45 JP302.1
N$20
  Top 0.406: R302.1 102.87,11.95 JP301.2 101.6,7.87 J301.C
N$21  (via drill 0.6)
  Top 0.406: JP301.1 105.41,11.95 R303.1 | J301.G1 95,2.79 v94.74,3.05 | J301.G4 108.2,2.79 v108.46,3.05
  Bottom 0.406: J301.G3 105.3,9.03 JP301.1 | J301.G3 J301.G2 95,2.79 v94.74,3.05 | J301.G3 108.2,2.79 v108.46,3.05
N$22
  Top 0.61: T101.9 52.07,24.13 49.53,26.67 T101.3
N$23
  Top 0.406: U302.5 104.9,24.13 104.14,23.37 100.58,23.37 99.55,22.34 R308.2 98.71,22.69 95.35,22.69 Q301.3
N$24
  Top 0.406: U301.4 90.17,20.35 | 90.17,20.35 94.06,20.35 Q301.1 | R309.2 90.17,20.35
N$25
  Top 0.406: U302.12 107.44,22.1 108.2,22.86 112.54,22.86 C301.1 113.01,22.62 121.16,14.48 R301.2
N$26
  Top 0.406: R306.2 TP13.TP | U302.13 108.71,17.27 TP13.TP | U302.14 109.98,17.53 TP13.TP
N$27  (via drill 0.6)
  Top 0.61: T101.2 50.29,29.21 v50.8,29.72 52.83,31.75 T101.12
  Bottom 0.61: R101.1 v50.8,29.72
N$28
  Top 1.27: R403.1 R402.1 D402.A
N$29
  Top 1.27: T102.12 47.75,132.08 45.21,129.54 T102.2 37.59,129.54 36.32,130.81 36.32,133.35 38.86,135.89 39.37,135.89 40.64,137.16 C119.1
N$30
  Top 1.27: T102.1 43.18,132.08 46.99,135.89 C120.1
N$31
  Top 1.27: C118.2 C119.2 C120.2 48.94,142.92 50.8,144.78 J102.C
N$32
  Top 0.406: R406.1 LED401.K
N$33
  Top 0.406: R407.1 LED402.K
N$34
  Top 0.61: J101.C C103.2 C102.2 C101.2
N$35
  Top 0.406: R210.1 74.68,63.74 C203.1 74.68,63.77 R209.2
N$36
  Top 0.406: R212.2 C206.1
N$37
  Top 0.406: R309.1 LED301.K
N$38
  Bottom 0.406: R216.2 C208.1
N$39
  Top 0.406: 63.5,49.53 R219.2 R220.2 62.61,45.08 C210.1
N$40
  Top 0.406: R208.1 26.92,50.56 C201.1 26.92,50.53 R207.2
N$41
  Top 0.61: T101.6 39.65,17.5 40.13,17.02 47.24,17.02 50.8,13.46 C103.1
N$42
  Top 0.406: C205.1 R211.2
N$43
  Top 0.61: U401.1 106.56,88.78 C403.1 R402.2
N$44
  Top 1.778: R401.1 F401.2 127.83,34.67 D401.K
N$45
  Top 1.778: F401.1 138.43,10.16 137.16,8.89 137.16,6.35 J401.1
N$46
  Top 1.27: D402.C 140.46,91.44 140.97,91.95
  Top 2.54: R401.2 140.97,50.8 C401.+ 140.97,91.95 140.97,107.7 140.76,107.9 C402.1 140.97,108.16 140.97,117.86 133.86,124.97 L401.1
N$47
  Top 0.406: 106.43,125.12 L402.1
  Top 0.61: 106.43,125.12 106.43,133.1 104.9,134.62 R405.1 R404.1
  Top 2.54: L402.1 113.54,124.97 | 113.54,124.97 L401.2 | C405.1 113.54,124.97
N$48
  Bottom 0.406: R215.2 C207.1
N$49
  Top 0.61: U402.1 106.05,65.41 C404.1 R403.2
N$50
  Top 0.406: R217.2 R218.2 38.99,69.22 C209.1
N$51
  Top 0.61: R408.2 95.5,106.17 96.77,107.44 100.84,107.44 101.6,106.68 J402.3
N$52
  Top 1.27: T102.11 48.77,129.54 46.23,127 T102.3 36.58,127 33.78,129.79 33.78,134.37 34.29,134.87 C118.1
N$53
  Top 0.406: R304.1 J302.C
N$57
  Top 0.61: T101.8 51.31,21.59 48.77,24.13 T101.4 37.59,24.13 35.56,22.1 35.56,16.26 37.85,13.97 41.91,13.97 43.18,12.7 C101.1
N$58
  Top 1.27: T102.4 47.24,124.46 49.78,127 T102.10
VB  (via drill 0.6)
  Top 0.406: 96.77,125.12 L402.2
  Top 0.61: 100.2,134.62 R405.2 | R405.2 98.55,134.62 96.77,132.84 96.77,125.12 | R404.2 R405.2
  Top 2.54: L402.2 89.92,124.97 89.66,124.71
  other vias: 86.36,125.98 85.09,125.98 87.63,125.98 16.51,125.98 15.24,125.98 13.97,125.98 29.21,123.44 26.67,123.44 24.13,123.44 74.93,123.7 72.39,123.7 77.47,123.7
  pour Bottom (isolate 0.406): 12.7,128.27 88.9,128.27 88.9,120.65 12.7,120.65
  pour Top: 12.7,128.27 12.7,122.94 30.48,122.94 30.48,134.11 18.54,134.11
  pour Top: 69.85,123.19 90.17,123.19 90.17,127 83.06,134.11 69.85,134.11
VB_CT  (via drill 0.6)
  Top 1.27: T102.7 v52.07,119.38 v50.55,119.38 v48.77,119.38 48.01,119.38 45.47,121.92 T102.5
  Bottom 0.813: R132.2 v50.55,119.38
  Bottom 1.27: v52.07,119.38 v50.55,119.38 v48.77,119.38
VB_CT1
  Top 0.61: T101.7 50.8,19.05 48.26,21.59 T101.5 38.1,21.59 36.83,20.32 36.83,17.02 38.35,15.49 45.47,15.49 46.99,13.97 C102.1

### Text on the board
Top: EASY RFPA FAB | Rev A | Mike Twieg 2022036